# Altium schematic sheet RUMBA32.SchDoc
size A1; PageSetup: Record=PageOptions|CenterHorizontal=True|CenterVertical=True|PrintScale=0.68|XCorrection=1.00|YCorrection=1.00|PrintKind=1|BorderSize=5000000|LeftOffset=0|BottomOffset=0|Orientation=2|PaperLength=1000|PaperWidth=1000|Scale=100|PaperSource=7|PrintQuality=-4|MediaType=1|DitherType=10|PrintScaleMode=1|PaperKind=A3
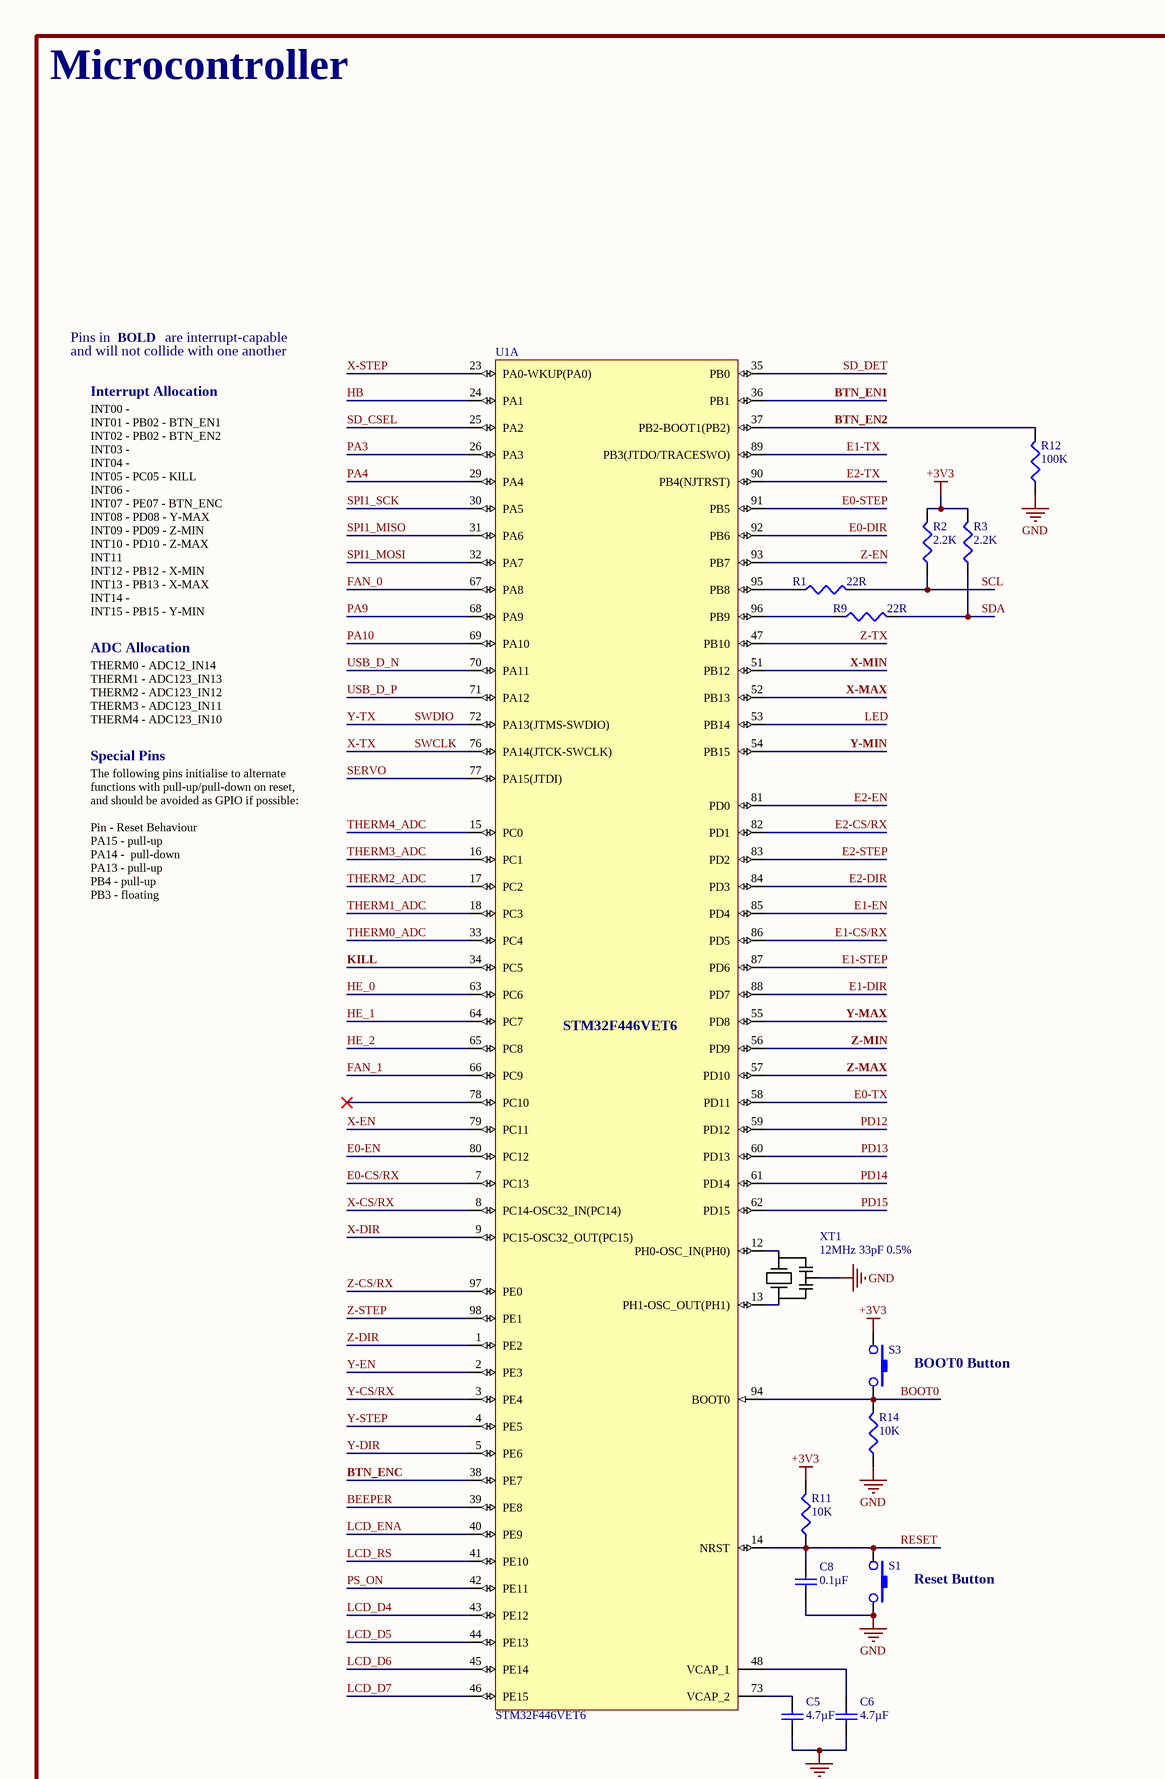
[diagram p0: RUMBA32.SchDoc, top left]
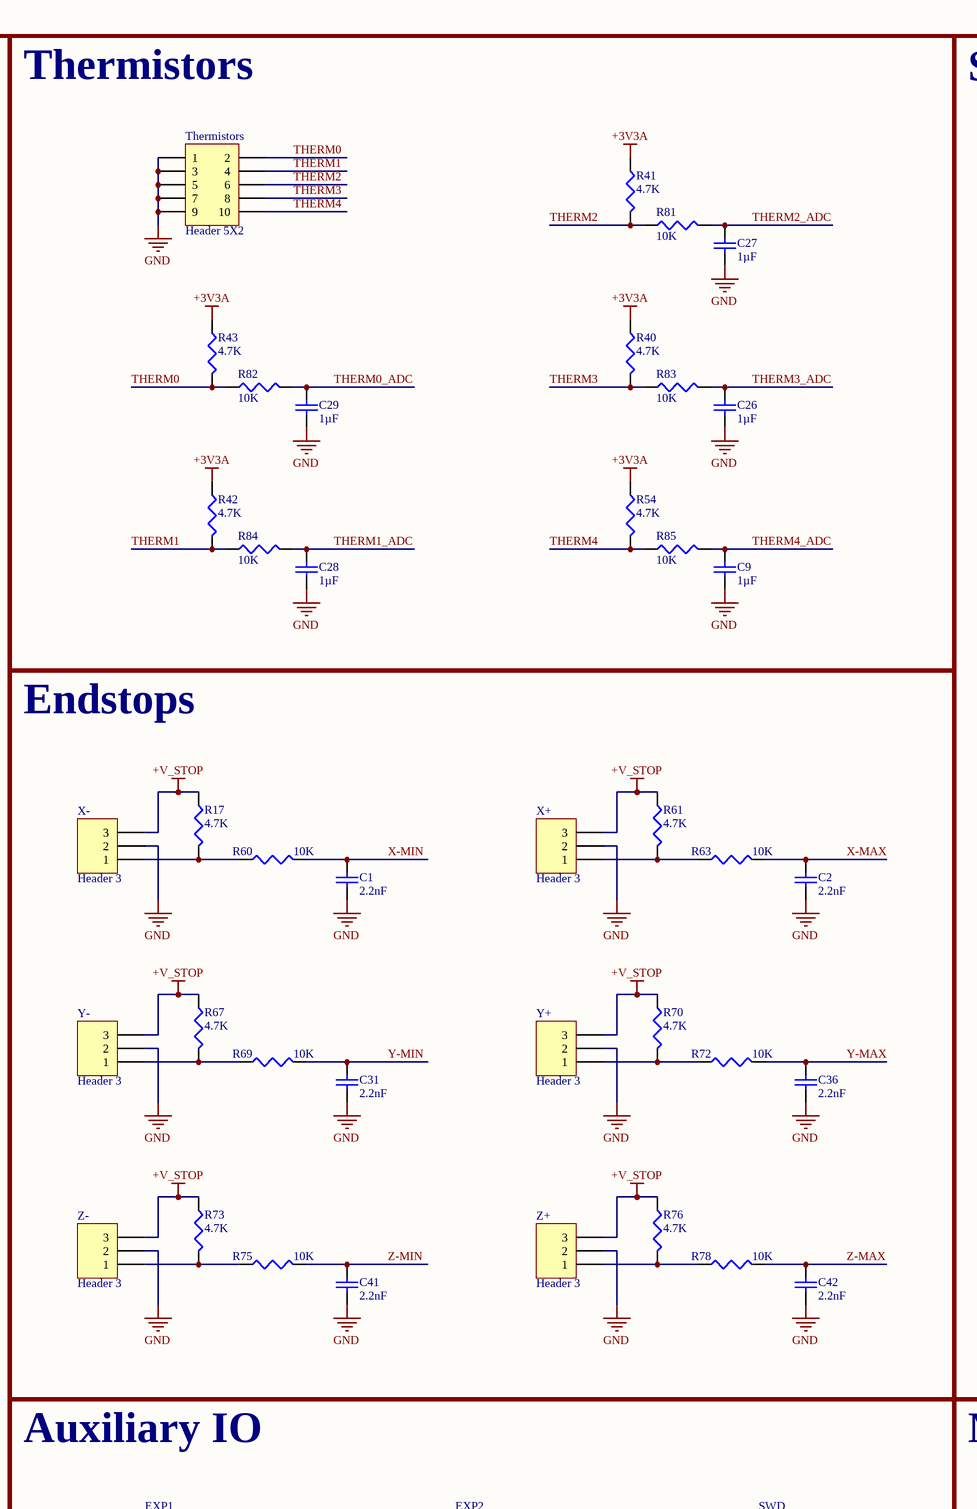
[diagram p1: RUMBA32.SchDoc, top middle]
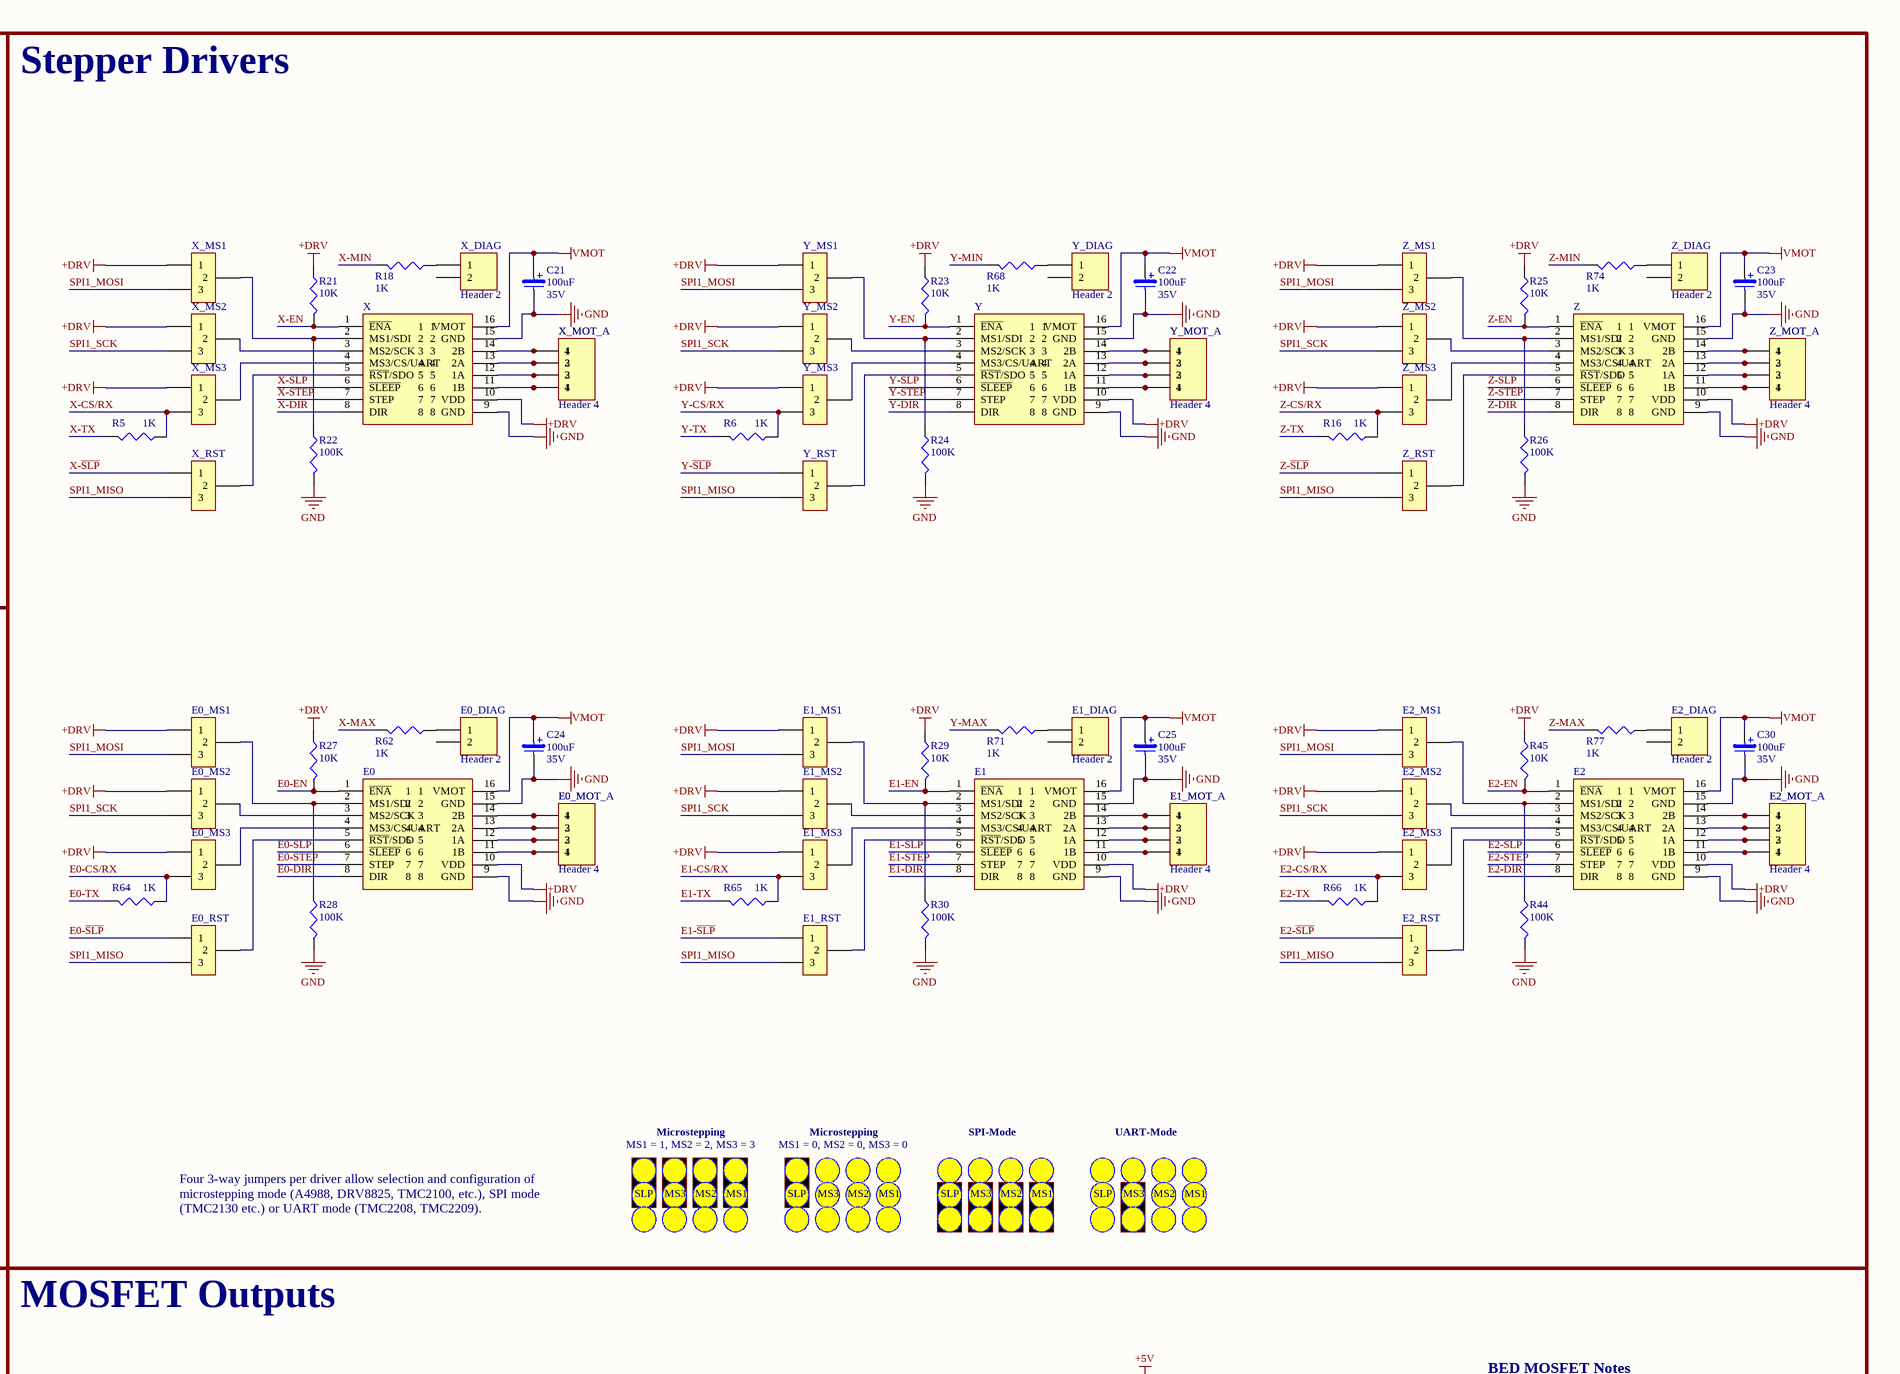
[diagram p2: RUMBA32.SchDoc, top right]
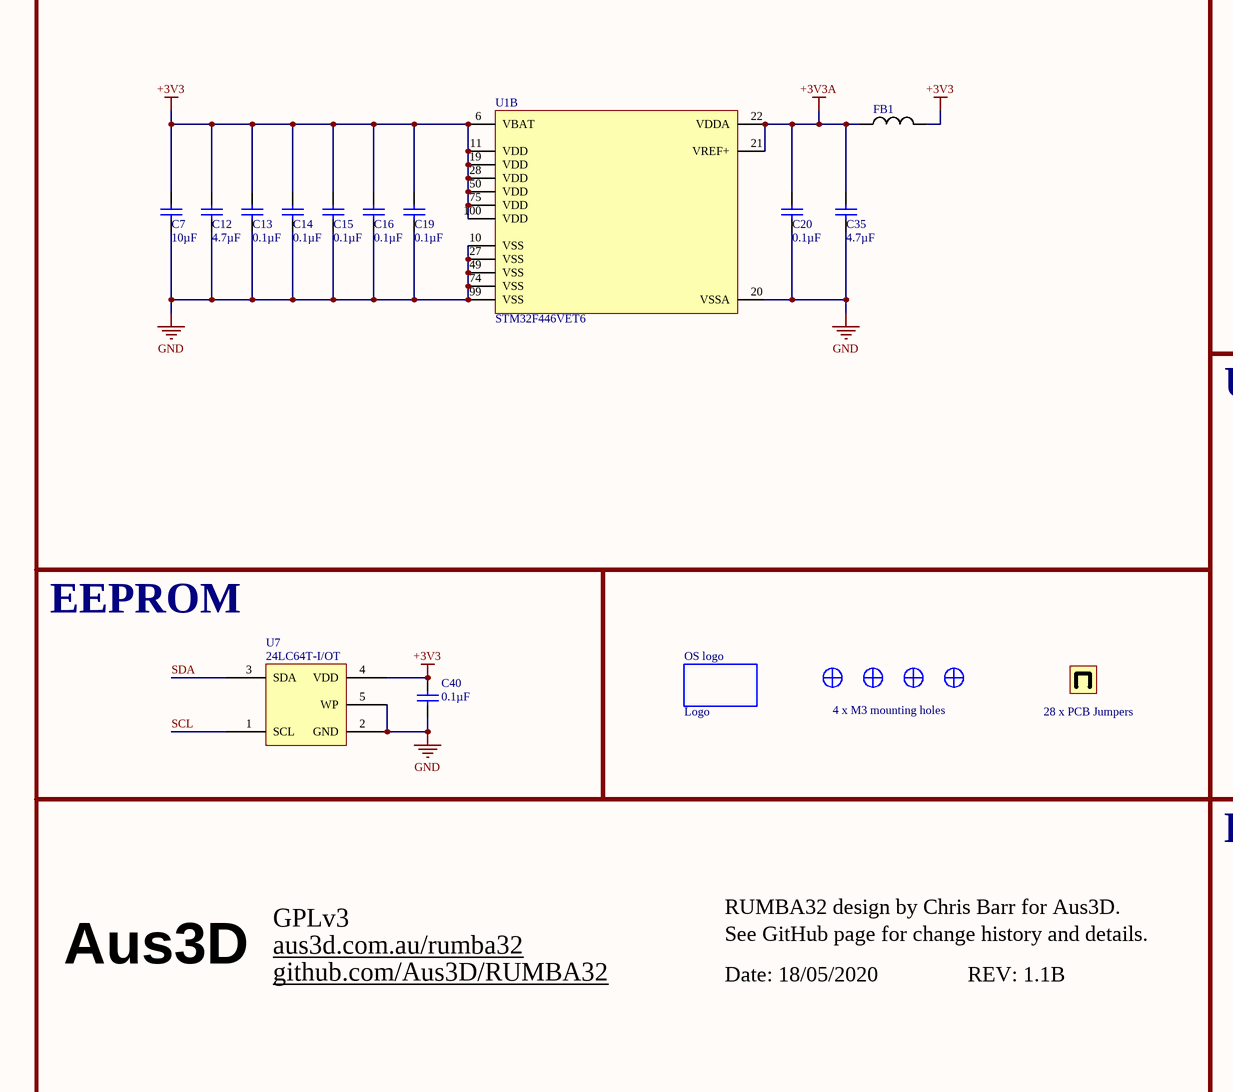
[diagram p3: RUMBA32.SchDoc, bottom left]
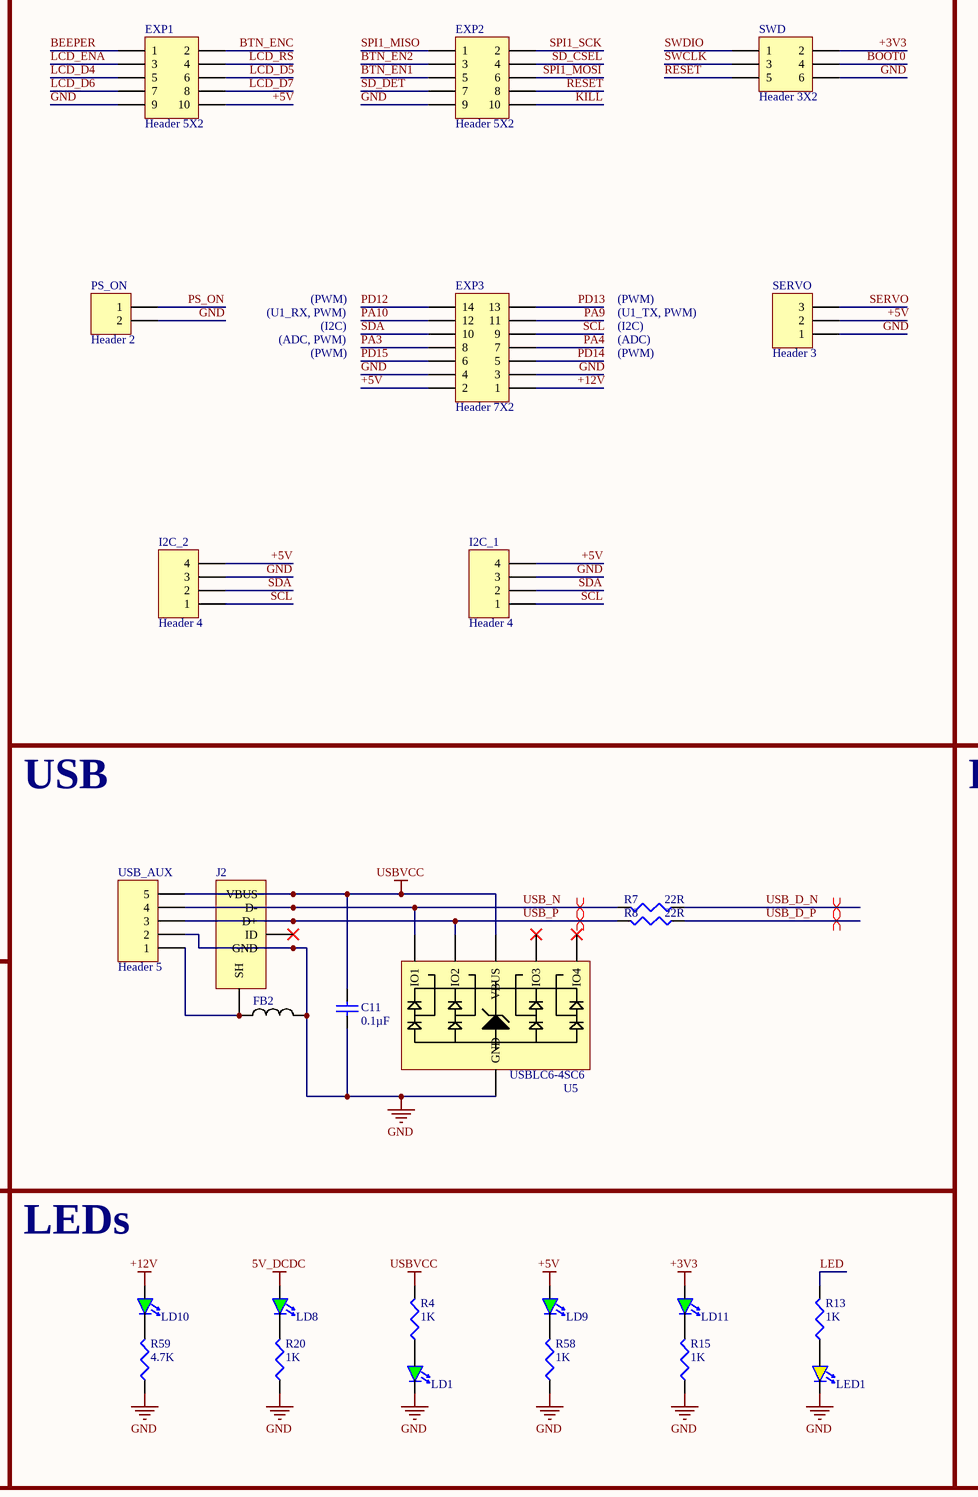
[diagram p4: RUMBA32.SchDoc, bottom middle]
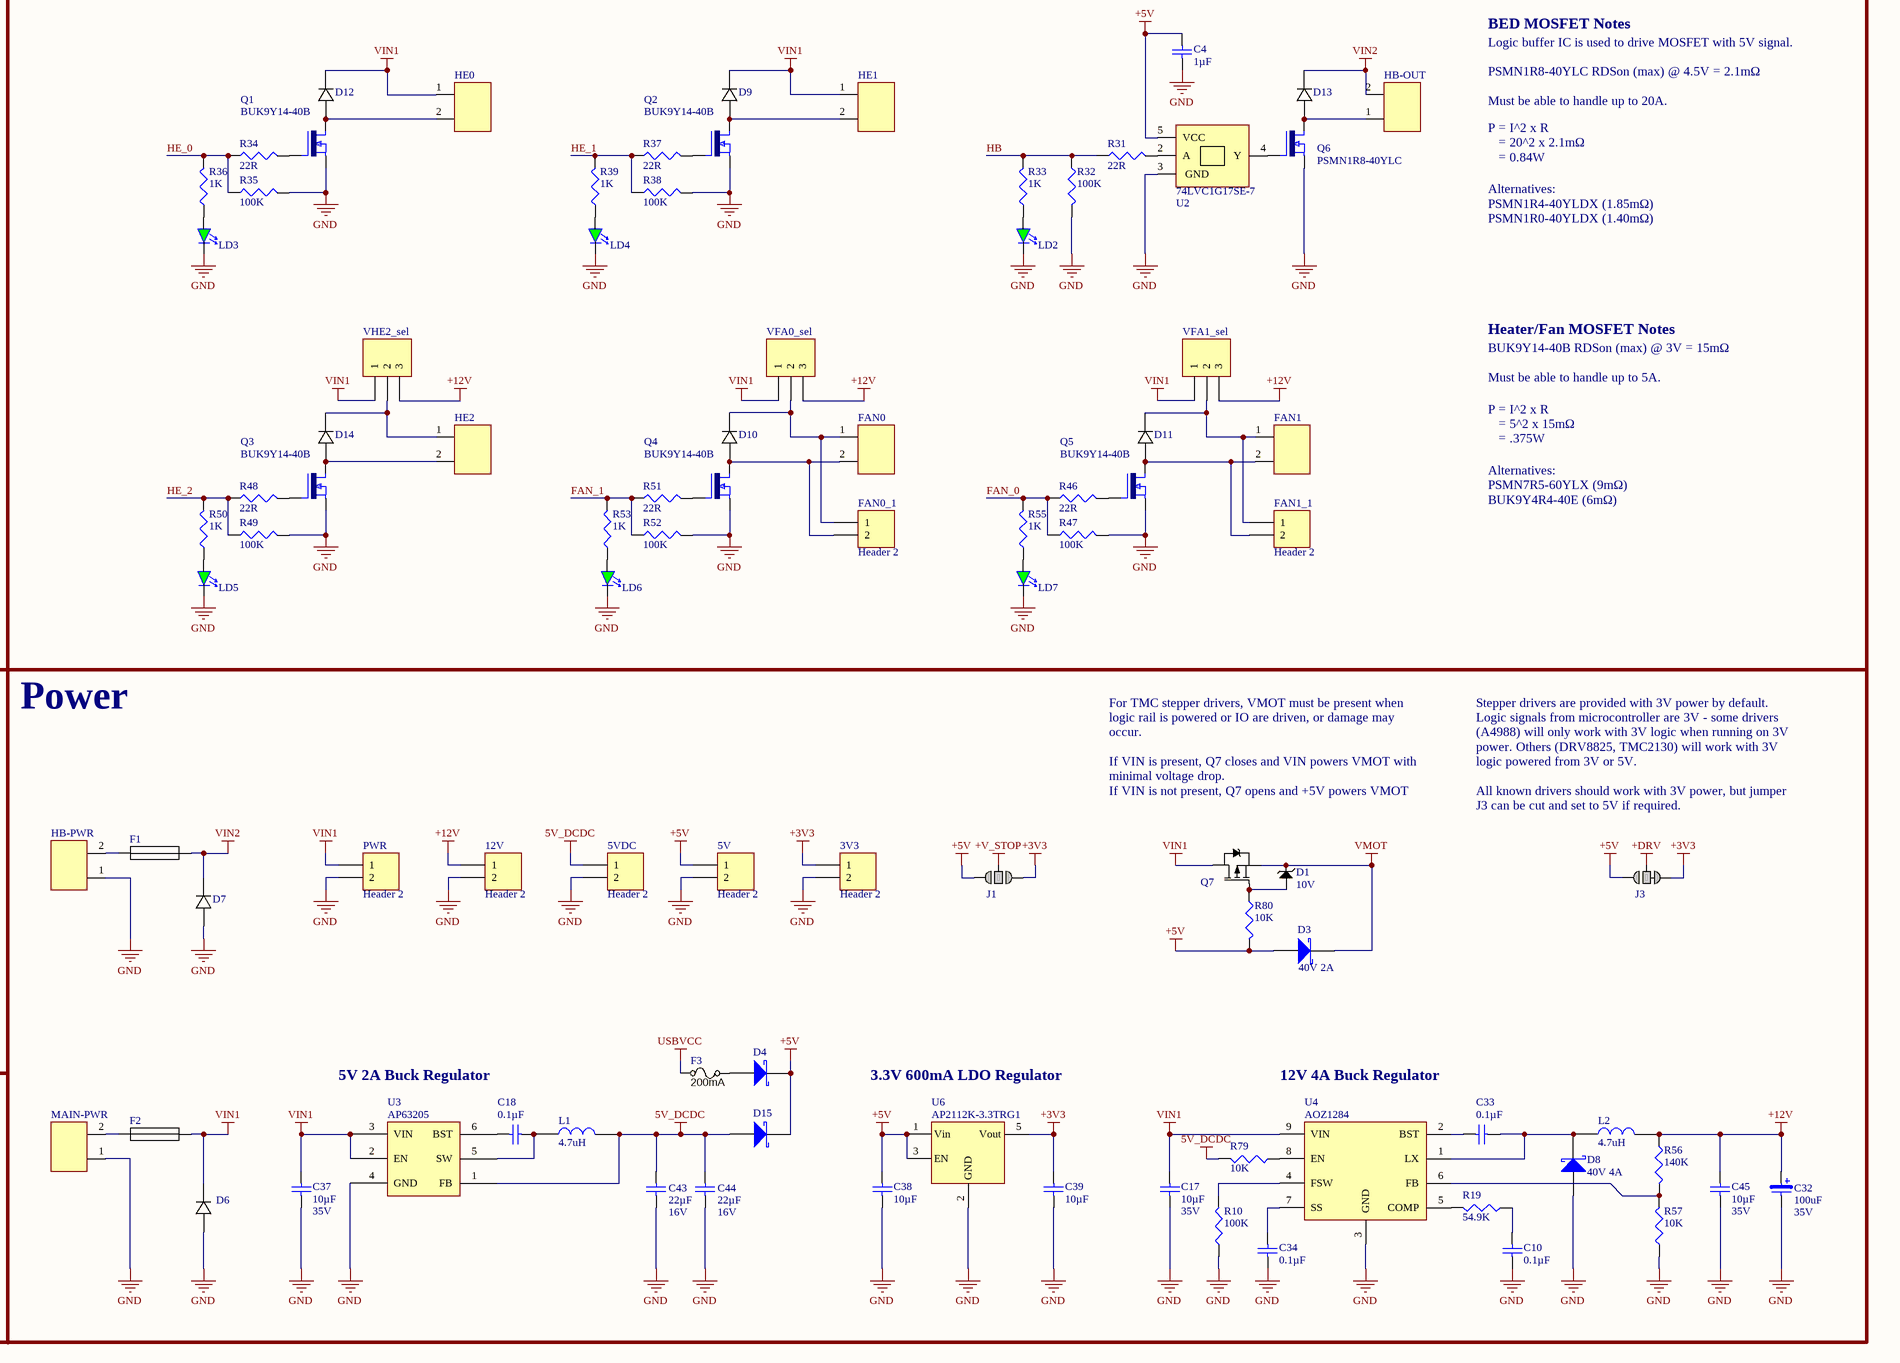
[diagram p5: RUMBA32.SchDoc, bottom right]

## Parts
(Parts that share a designator on the sheet are numbered #1, #2 ... from top to bottom, then left to right.)
3V3  Header 2  [HDR1X2-HEADER]
5V  Header 2  [HDR1X2-HEADER]
5VDC  Header 2  [HDR1X2-HEADER]
12V  Header 2  [HDR1X2-HEADER]
C1  value 2.2nF  [CAPC1005X55N]  (hidden comment: Capacitor)
C2  value 2.2nF  [CAPC1005X55N]  (hidden comment: Capacitor)
C4  value 1µF  [CAP 1005-0402]  (hidden comment: Capacitor)
C5  value 4.7µF  [CAP 1005-0402]  (hidden comment: Capacitor)
C6  value 4.7µF  [CAP 1005-0402]  (hidden comment: Capacitor)
C7  value 10µF  [CAPC1608X90N]  (hidden comment: Capacitor)
C8  value 0.1µF  [CAP 1005-0402]  (hidden comment: Capacitor)
C9  value 1µF  [CAPC1005X55N]  (hidden comment: Capacitor)
C10  value 0.1µF  [CAP 1005-0402]  (hidden comment: Capacitor)
C11  value 0.1µF  [CAP 1005-0402]  (hidden comment: Capacitor)
C12  value 4.7µF  [CAPC1005X55N]  (hidden comment: Capacitor)
C13  value 0.1µF  [CAP 1005-0402]  (hidden comment: Capacitor)
C14  value 0.1µF  [CAP 1005-0402]  (hidden comment: Capacitor)
C15  value 0.1µF  [CAP 1005-0402]  (hidden comment: Capacitor)
C16  value 0.1µF  [CAP 1005-0402]  (hidden comment: Capacitor)
C17  value 10µF  Voltage: 35V  [CAPC3225X220N]  (hidden comment: Capacitor)
C18  value 0.1µF  [CAP 1005-0402]  (hidden comment: Capacitor)
C19  value 0.1µF  [CAP 1005-0402]  (hidden comment: Capacitor)
C20  value 0.1µF  [CAP 1005-0402]  (hidden comment: Capacitor)
C21  value 100uF  Voltage: 35V  [CAP EL PANASONIC]
C22  value 100uF  Voltage: 35V  [CAP EL PANASONIC]
C23  value 100uF  Voltage: 35V  [CAP EL PANASONIC]
C24  value 100uF  Voltage: 35V  [CAP EL PANASONIC]
C25  value 100uF  Voltage: 35V  [CAP EL PANASONIC]
C26  value 1µF  [CAPC1005X55N]  (hidden comment: Capacitor)
C27  value 1µF  [CAPC1005X55N]  (hidden comment: Capacitor)
C28  value 1µF  [CAPC1005X55N]  (hidden comment: Capacitor)
C29  value 1µF  [CAPC1005X55N]  (hidden comment: Capacitor)
C30  value 100uF  Voltage: 35V  [CAP EL PANASONIC]
C31  value 2.2nF  [CAPC1005X55N]  (hidden comment: Capacitor)
C32  value 100uF  Voltage: 35V  [CAP EL PANASONIC]
C33  value 0.1µF  [CAP 1005-0402]  (hidden comment: Capacitor)
C34  value 0.1µF  [CAP 1005-0402]  (hidden comment: Capacitor)
C35  value 4.7µF  [CAP 1005-0402]  (hidden comment: Capacitor)
C36  value 2.2nF  [CAPC1005X55N]  (hidden comment: Capacitor)
C37  value 10µF  Voltage: 35V  [CAPC3225X220N]  (hidden comment: Capacitor)
C38  value 10µF  [CAPC1608X90N]  (hidden comment: Capacitor)
C39  value 10µF  [CAPC1608X90N]  (hidden comment: Capacitor)
C40  value 0.1µF  [CAP 1005-0402]  (hidden comment: Capacitor)
C41  value 2.2nF  [CAPC1005X55N]  (hidden comment: Capacitor)
C42  value 2.2nF  [CAPC1005X55N]  (hidden comment: Capacitor)
C43  value 22µF  Voltage: 16V  [CAPC3225X220N]  (hidden comment: Capacitor)
C44  value 22µF  Voltage: 16V  [CAPC3225X220N]  (hidden comment: Capacitor)
C45  value 10µF  Voltage: 35V  [CAPC3225X220N]  (hidden comment: Capacitor)
D1  Voltage: 10V  [SOD523]  (hidden comment: Zener 10V 150mW SOD523)
D3  value 40V 2A  [DIOM2616X08N]
D4  (no value)  [DIOM2616X08N]
D6  (no value)  [DO-214AC]
D7  (no value)  [DO-214AC]
D8  value 40V 4A  [DO-214AA]
D9  (no value)  [DO-214AC]
D10  (no value)  [DO-214AC]
D11  (no value)  [DO-214AC]
D12  (no value)  [DO-214AC]
D13  (no value)  [DO-214AC]
D14  (no value)  [DO-214AC]
D15  (no value)  [DIOM2616X08N]
E0  Header 8  [A4988BREAKOUT_2]  (value not drawn)  (no BOM)
E0_0  Header 8  [HDR1X8-HEADER]  (value not drawn)  (mechanical)
E0_1  Header 8  [HDR1X8-HEADER]  (value not drawn)  (mechanical)
E0_DIAG  Header 2  [HDR1X2-HEADER Female]
E0_MOT  (no value)  [TERM4 3.5mm]
E0_MOT_A  Header 4  [HDR1X4]
E0_MS1  Header 3  [HDR1X3-HEADER]  (value not drawn)
E0_MS2  Header 3  [HDR1X3-HEADER]  (value not drawn)
E0_MS3  Header 3  [HDR1X3-HEADER]  (value not drawn)
E0_RST  Header 3  [HDR1X3-HEADER]  (value not drawn)
E1  Header 8  [A4988BREAKOUT_2]  (value not drawn)  (no BOM)
E1_0  Header 8  [HDR1X8-HEADER]  (value not drawn)  (mechanical)
E1_1  Header 8  [HDR1X8-HEADER]  (value not drawn)  (mechanical)
E1_DIAG  Header 2  [HDR1X2-HEADER Female]
E1_MOT  (no value)  [TERM4 3.5mm]
E1_MOT_A  Header 4  [HDR1X4]
E1_MS1  Header 3  [HDR1X3-HEADER]  (value not drawn)
E1_MS2  Header 3  [HDR1X3-HEADER]  (value not drawn)
E1_MS3  Header 3  [HDR1X3-HEADER]  (value not drawn)
E1_RST  Header 3  [HDR1X3-HEADER]  (value not drawn)
E2  Header 8  [A4988BREAKOUT_2]  (value not drawn)  (no BOM)
E2_0  Header 8  [HDR1X8-HEADER]  (value not drawn)  (mechanical)
E2_1  Header 8  [HDR1X8-HEADER]  (value not drawn)  (mechanical)
E2_DIAG  Header 2  [HDR1X2-HEADER Female]
E2_MOT  (no value)  [TERM4 3.5mm]
E2_MOT_A  Header 4  [HDR1X4]
E2_MS1  Header 3  [HDR1X3-HEADER]  (value not drawn)
E2_MS2  Header 3  [HDR1X3-HEADER]  (value not drawn)
E2_MS3  Header 3  [HDR1X3-HEADER]  (value not drawn)
E2_RST  Header 3  [HDR1X3-HEADER]  (value not drawn)
EXP1  Header 5X2  [HDR2X5_exp Iner only\]
EXP2  Header 5X2  [HDR2X5_exp Iner only\]
EXP3  Header 7X2  [HDR2X7]
F1  (no value)  [Fuseholder - BK-6013 - Mini ATC ATO Blade 15A]
F2  (no value)  [Fuseholder - BK-6013 - Mini ATC ATO Blade 15A]
F3  value 200mA  [FUSE 1608-0603]
FAN0  (no value)  [TERM2 3.5mm]
FAN0_1  Header 2  [HDR1X2]
FAN1  (no value)  [TERM2 3.5mm]
FAN1_1  Header 2  [HDR1X2]
FB1  Ferrite Bead SMD 0402  [RESC1005X40N]  (value not drawn)
FB2  Ferrite Bead SMD 0402  [RESC1005X40N]  (value not drawn)
HB-OUT  (no value)  [TERM2 5MM]
HB-PWR  (no value)  [TERM2 5MM]
HE0  (no value)  [TERM2 3.5mm]
HE1  (no value)  [TERM2 3.5mm]
HE2  (no value)  [TERM2 3.5mm]
I2C_1  Header 4  [HDR1X4-HEADER]
I2C_2  Header 4  [HDR1X4-HEADER]
J1  Jumper  [Jump_3Way - SMALL]  (value not drawn)  (no BOM)
J2  (no value)  [Micro-USB B Molex 105017-0001]
J3  Jumper  [Jump_3Way - SMALL]  (value not drawn)  (no BOM)
JMP1  Green  (value not drawn)  (mechanical)
JMP#1  Green  (value not drawn)  (mechanical)
JMP#2  Green  (value not drawn)  (mechanical)
JMP#3  Green  (value not drawn)  (mechanical)
JMP#4  Green  (value not drawn)  (mechanical)
JMP#5  Green  (value not drawn)  (mechanical)
JMP#6  Green  (value not drawn)  (mechanical)
JMP#7  Green  (value not drawn)  (mechanical)
JMP#8  Green  (value not drawn)  (mechanical)
JMP#9  Green  (value not drawn)  (mechanical)
JMP#10  Green  (value not drawn)  (mechanical)
JMP#11  Green  (value not drawn)  (mechanical)
JMP#12  Green  (value not drawn)  (mechanical)
JMP#13  Green  (value not drawn)  (mechanical)
JMP#14  Green  (value not drawn)  (mechanical)
JMP#15  Green  (value not drawn)  (mechanical)
JMP#16  Green  (value not drawn)  (mechanical)
JMP#17  Green  (value not drawn)  (mechanical)
JMP#18  Green  (value not drawn)  (mechanical)
JMP#19  Green  (value not drawn)  (mechanical)
JMP#20  Green  (value not drawn)  (mechanical)
JMP#21  Green  (value not drawn)  (mechanical)
JMP#22  Green  (value not drawn)  (mechanical)
JMP#23  Green  (value not drawn)  (mechanical)
JMP#24  Green  (value not drawn)  (mechanical)
JMP#25  Green  (value not drawn)  (mechanical)
JMP#26  Green  (value not drawn)  (mechanical)
JMP#27  Green  (value not drawn)  (mechanical)
L1  value 4.7uH  [SRN6045TA SMD Inductor]
L2  value 4.7uH  [SRN6045TA SMD Inductor]
LD1  (no value)  [LED 1608-0603]
LD2  (no value)  [LED 1608-0603]
LD3  (no value)  [LED 1608-0603]
LD4  (no value)  [LED 1608-0603]
LD5  (no value)  [LED 1608-0603]
LD6  (no value)  [LED 1608-0603]
LD7  (no value)  [LED 1608-0603]
LD8  (no value)  [LED 1608-0603]
LD9  (no value)  [LED 1608-0603]
LD10  (no value)  [LED 1608-0603]
LD11  (no value)  [LED 1608-0603]
LED1  (no value)  [LED 1608-0603]
MAIN-PWR  (no value)  [TERM2 5MM]
OS_logo  Logo  [OS LOGO TOP]  (no BOM)
PS_ON  Header 2  [HDR1X2-HEADER]
PWR  Header 2  [HDR1X2-HEADER]
Q1  BUK9Y14-40B  [LFPACK]
Q2  BUK9Y14-40B  [LFPACK]
Q3  BUK9Y14-40B  [LFPACK]
Q4  BUK9Y14-40B  [LFPACK]
Q5  BUK9Y14-40B  [LFPACK]
Q6  PSMN1R8-40YLC  [LFPACK]
Q7  Si2371EDS  [SOT23-3 New]  (value not drawn)
R1  value 22R  [RESC1005X40N]  (hidden comment: Resistor)
R2  value 2.2K  [RESC1005X40N]  (hidden comment: Resistor)
R3  value 2.2K  [RESC1005X40N]  (hidden comment: Resistor)
R4  value 1K  [RESC1005X40N]  (hidden comment: Resistor)
R5  value 1K  [RESC1005X40N]  (hidden comment: Resistor)
R6  value 1K  [RESC1005X40N]  (hidden comment: Resistor)
R7  value 22R  [RESC1005X40N]  (hidden comment: Resistor)
R8  value 22R  [RESC1005X40N]  (hidden comment: Resistor)
R9  value 22R  [RESC1005X40N]  (hidden comment: Resistor)
R10  value 100K  [RESC1005X40N]  (hidden comment: Resistor)
R11  value 10K  [RESC1005X40N]  (hidden comment: Resistor)
R12  value 100K  [RESC1005X40N]  (hidden comment: Resistor)
R13  value 1K  [RESC1005X40N]  (hidden comment: Resistor)
R14  value 10K  [RESC1005X40N]  (hidden comment: Resistor)
R15  value 1K  [RESC1005X40N]  (hidden comment: Resistor)
R16  value 1K  [RESC1005X40N]  (hidden comment: Resistor)
R17  value 4.7K  [RESC1005X40N]  (hidden comment: Resistor)
R18  value 1K  [RESC1005X40N]  (hidden comment: Resistor)
R19  value 54.9K  [RESC1005X40N]  (hidden comment: Resistor)
R20  value 1K  [RESC1005X40N]  (hidden comment: Resistor)
R21  value 10K  [RESC1005X40N]  (hidden comment: Resistor)
R22  value 100K  [RESC1005X40N]  (hidden comment: Resistor)
R23  value 10K  [RESC1005X40N]  (hidden comment: Resistor)
R24  value 100K  [RESC1005X40N]  (hidden comment: Resistor)
R25  value 10K  [RESC1005X40N]  (hidden comment: Resistor)
R26  value 100K  [RESC1005X40N]  (hidden comment: Resistor)
R27  value 10K  [RESC1005X40N]  (hidden comment: Resistor)
R28  value 100K  [RESC1005X40N]  (hidden comment: Resistor)
R29  value 10K  [RESC1005X40N]  (hidden comment: Resistor)
R30  value 100K  [RESC1005X40N]  (hidden comment: Resistor)
R31  value 22R  [RESC1005X40N]  (hidden comment: Resistor)
R32  value 100K  [RESC1005X40N]  (hidden comment: Resistor)
R33  value 1K  [RESC1005X40N]  (hidden comment: Resistor)
R34  value 22R  [RESC1005X40N]  (hidden comment: Resistor)
R35  value 100K  [RESC1005X40N]  (hidden comment: Resistor)
R36  value 1K  [RESC1005X40N]  (hidden comment: Resistor)
R37  value 22R  [RESC1005X40N]  (hidden comment: Resistor)
R38  value 100K  [RESC1005X40N]  (hidden comment: Resistor)
R39  value 1K  [RESC1005X40N]  (hidden comment: Resistor)
R40  value 4.7K  [RESC1005X40N]  (hidden comment: Resistor)
R41  value 4.7K  [RESC1005X40N]  (hidden comment: Resistor)
R42  value 4.7K  [RESC1005X40N]  (hidden comment: Resistor)
R43  value 4.7K  [RESC1005X40N]  (hidden comment: Resistor)
R44  value 100K  [RESC1005X40N]  (hidden comment: Resistor)
R45  value 10K  [RESC1005X40N]  (hidden comment: Resistor)
R46  value 22R  [RESC1005X40N]  (hidden comment: Resistor)
R47  value 100K  [RESC1005X40N]  (hidden comment: Resistor)
R48  value 22R  [RESC1005X40N]  (hidden comment: Resistor)
R49  value 100K  [RESC1005X40N]  (hidden comment: Resistor)
R50  value 1K  [RESC1005X40N]  (hidden comment: Resistor)
R51  value 22R  [RESC1005X40N]  (hidden comment: Resistor)
R52  value 100K  [RESC1005X40N]  (hidden comment: Resistor)
R53  value 1K  [RESC1005X40N]  (hidden comment: Resistor)
R54  value 4.7K  [RESC1005X40N]  (hidden comment: Resistor)
R55  value 1K  [RESC1005X40N]  (hidden comment: Resistor)
R56  value 140K  [RESC1005X40N]  (hidden comment: Resistor)
R57  value 10K  [RESC1005X40N]  (hidden comment: Resistor)
R58  value 1K  [RESC1005X40N]  (hidden comment: Resistor)
R59  value 4.7K  [RESC1005X40N]  (hidden comment: Resistor)
R60  value 10K  [RESC1005X40N]  (hidden comment: Resistor)
R61  value 4.7K  [RESC1005X40N]  (hidden comment: Resistor)
R62  value 1K  [RESC1005X40N]  (hidden comment: Resistor)
R63  value 10K  [RESC1005X40N]  (hidden comment: Resistor)
R64  value 1K  [RESC1005X40N]  (hidden comment: Resistor)
R65  value 1K  [RESC1005X40N]  (hidden comment: Resistor)
R66  value 1K  [RESC1005X40N]  (hidden comment: Resistor)
R67  value 4.7K  [RESC1005X40N]  (hidden comment: Resistor)
R68  value 1K  [RESC1005X40N]  (hidden comment: Resistor)
R69  value 10K  [RESC1005X40N]  (hidden comment: Resistor)
R70  value 4.7K  [RESC1005X40N]  (hidden comment: Resistor)
R71  value 1K  [RESC1005X40N]  (hidden comment: Resistor)
R72  value 10K  [RESC1005X40N]  (hidden comment: Resistor)
R73  value 4.7K  [RESC1005X40N]  (hidden comment: Resistor)
R74  value 1K  [RESC1005X40N]  (hidden comment: Resistor)
R75  value 10K  [RESC1005X40N]  (hidden comment: Resistor)
R76  value 4.7K  [RESC1005X40N]  (hidden comment: Resistor)
R77  value 1K  [RESC1005X40N]  (hidden comment: Resistor)
R78  value 10K  [RESC1005X40N]  (hidden comment: Resistor)
R79  value 10K  [RESC1005X40N]  (hidden comment: Resistor)
R80  value 10K  [RESC1005X40N]  (hidden comment: Resistor)
R81  value 10K  [RESC1005X40N]  (hidden comment: Resistor)
R82  value 10K  [RESC1005X40N]  (hidden comment: Resistor)
R83  value 10K  [RESC1005X40N]  (hidden comment: Resistor)
R84  value 10K  [RESC1005X40N]  (hidden comment: Resistor)
R85  value 10K  [RESC1005X40N]  (hidden comment: Resistor)
S1  Momentary Tactile Button  [SW-PB SMD 2pin]  (value not drawn)
S3  Momentary Tactile Button  [SW-PB SMD 2pin]  (value not drawn)
sc1  Sraf  [Sraf 3mm - rupa 3.2]  (value not drawn)  (no BOM)
sc2  Sraf  [Sraf 3mm - rupa 3.2]  (value not drawn)  (no BOM)
sc3  Sraf  [Sraf 3mm - rupa 3.5]  (value not drawn)  (no BOM)
sc4  Sraf  [Sraf 3mm - rupa 3.5]  (value not drawn)  (no BOM)
SERVO  Header 3  [HDR1X3-HEADER]
SWD  Header 3X2  [HDR2X3]
Thermistors  Header 5X2  [HDR2X5]
U1  STM32F446VET6  [STM-LQFP100_N]  (parts A,B of 2)
U2  74LVC1G17SE-7  [SOT353]
U3  AP63205  [TSOT23-6]
U4  AOZ1284  [SOIC127P600X170_HS-9N]
U5  USBLC6-4SC6  [TSOT23-6]
U6  AP2112K-3.3TRG1  [SOT23-5]
U7  24LC64T-I/OT  [SOT23-5]
USB_AUX  Header 5  [HDR1X5-HEADER]
VFA0_sel  Header 3  [HDR1X3-HEADER]  (value not drawn)
VFA1_sel  Header 3  [HDR1X3-HEADER]  (value not drawn)
VHE2_sel  Header 3  [HDR1X3-HEADER]  (value not drawn)
X  Header 8  [A4988BREAKOUT_2]  (value not drawn)  (no BOM)
X+  Header 3  [HDR1X3-HEADER]
X-  Header 3  [HDR1X3-HEADER]
X_0  Header 8  [HDR1X8-HEADER]  (value not drawn)  (mechanical)
X_1  Header 8  [HDR1X8-HEADER]  (value not drawn)  (mechanical)
X_DIAG  Header 2  [HDR1X2-HEADER Female]
X_MOT  (no value)  [TERM4 3.5mm]
X_MOT_A  Header 4  [HDR1X4]
X_MS1  Header 3  [HDR1X3-HEADER]  (value not drawn)
X_MS2  Header 3  [HDR1X3-HEADER]  (value not drawn)
X_MS3  Header 3  [HDR1X3-HEADER]  (value not drawn)
X_RST  Header 3  [HDR1X3-HEADER]  (value not drawn)
XT1  12MHz 33pF 0.5%  [CERALOCK CSTCE_G]
Y  Header 8  [A4988BREAKOUT_2]  (value not drawn)  (no BOM)
Y+  Header 3  [HDR1X3-HEADER]
Y-  Header 3  [HDR1X3-HEADER]
Y_0  Header 8  [HDR1X8-HEADER]  (value not drawn)  (mechanical)
Y_1  Header 8  [HDR1X8-HEADER]  (value not drawn)  (mechanical)
Y_DIAG  Header 2  [HDR1X2-HEADER Female]
Y_MOT  (no value)  [TERM4 3.5mm]
Y_MOT_A  Header 4  [HDR1X4]
Y_MS1  Header 3  [HDR1X3-HEADER]  (value not drawn)
Y_MS2  Header 3  [HDR1X3-HEADER]  (value not drawn)
Y_MS3  Header 3  [HDR1X3-HEADER]  (value not drawn)
Y_RST  Header 3  [HDR1X3-HEADER]  (value not drawn)
Z  Header 8  [A4988BREAKOUT_2]  (value not drawn)  (no BOM)
Z+  Header 3  [HDR1X3-HEADER]
Z-  Header 3  [HDR1X3-HEADER]
Z_0  Header 8  [HDR1X8-HEADER]  (value not drawn)  (mechanical)
Z_1  Header 8  [HDR1X8-HEADER]  (value not drawn)  (mechanical)
Z_DIAG  Header 2  [HDR1X2-HEADER Female]
Z_MOT  (no value)  [TERM4 3.5mm]
Z_MOT_A  Header 4  [HDR1X4]
Z_MS1  Header 3  [HDR1X3-HEADER]  (value not drawn)
Z_MS2  Header 3  [HDR1X3-HEADER]  (value not drawn)
Z_MS3  Header 3  [HDR1X3-HEADER]  (value not drawn)
Z_RST  Header 3  [HDR1X3-HEADER]  (value not drawn)

## Blocks framed on the sheet
Microcontroller: C5-C8 C12-C16 C19 C20 C35 FB1 R1-R3 R9 R11 R12 R14 S1 S3 U1 XT1
Thermistors: C9 C26-C29 R40-R43 R54 R81-R85 Thermistors
Stepper Drivers: C21-C25 C30 E0 E0_0 E0_1 E0_DIAG E0_MOT E0_MOT_A E0_MS1-E0_MS3 E0_RST E1 E1_0 E1_1 E1_DIAG E1_MOT E1_MOT_A E1_MS1-E1_MS3 E1_RST E2 E2_0 E2_1 E2_DIAG E2_MOT E2_MOT_A E2_MS1-E2_MS3 E2_RST R5 R6 R16 R18 R21-R30 R44 R45 R62 R64-R66 R68 R71 R74 R77 X X_0 X_1 X_DIAG X_MOT X_MOT_A X_MS1-X_MS3 X_RST Y Y_0 Y_1 Y_DIAG Y_MOT Y_MOT_A Y_MS1-Y_MS3 Y_RST Z Z_0 Z_1 Z_DIAG Z_MOT Z_MOT_A Z_MS1-Z_MS3 Z_RST
Endstops: C1 C2 C31 C36 C41 C42 R17 R60 R61 R63 R67 R69 R70 R72 R73 R75 R76 R78 X+ X- Y+ Y- Z+ Z-
Auxiliary IO: EXP1-EXP3 I2C_1 I2C_2 PS_ON SERVO SWD
MOSFET Outputs: C4 D9-D14 FAN0 FAN0_1 FAN1 FAN1_1 HB-OUT HE0-HE2 LD2-LD7 Q1-Q6 R31-R39 R46-R53 R55 U2 VFA0_sel VFA1_sel VHE2_sel
USB: C11 FB2 J2 R7 R8 U5 USB_AUX
Power: 3V3 5V 5VDC 12V C10 C17 C18 C32-C34 C37-C39 C43-C45 D1 D3 D4 D6-D8 D15 F1-F3 HB-PWR J1 J3 L1 L2 MAIN-PWR PWR Q7 R10 R19 R56 R57 R79 R80 U3 U4 U6
EEPROM: C40 U7
LEDs: LD1 LD8-LD11 LED1 R4 R13 R15 R20 R58 R59

## Nets
5V_DCDC: 5VDC.1 C43.2 C44.2 D15.A L1.2 LD8.1(A) R79.2 U3.1(FB)
+3V3: 3V3.1 C7.2 C12.2 C13.2 C14.2 C15.2 C16.2 C19.2 C39.2 C40.2 FB1.2 J1.1 J3.1 LD11.1(A) R2.2 R3.2 R11.2 S3.1 SWD.2 U1.6(VBAT) U1.11(VDD) U1.19(VDD) U1.28(VDD) U1.50(VDD) U1.75(VDD) U1.100(VDD) U6.5(Vout) U7.4(VDD)
+3V3A: C20.2 C35.2 FB1.1 R40.1 R41.1 R42.1 R43.1 R54.1 U1.21(VREF+) U1.22(VDDA)
+5V: 5V.1 C4.2 C38.2 D3.A D4.K D15.K EXP1.10 EXP3.2 I2C_1.4 I2C_2.4 J1.3 J3.3 LD9.1(A) R80.2 SERVO.2 U2.5(VCC) U6.1(Vin) U6.3(EN)
+12V: 12V.1 C32.1 C45.2 EXP3.1 L2.2 LD10.1(A) R56.1 VFA0_sel.3 VFA1_sel.3 VHE2_sel.3
+DRV: E0.10(VDD) E0_MS1.1 E0_MS2.1 E0_MS3.1 E1.10(VDD) E1_MS1.1 E1_MS2.1 E1_MS3.1 E2.10(VDD) E2_MS1.1 E2_MS2.1 E2_MS3.1 J3.2 R21.1 R23.1 R25.1 R27.1 R29.1 R45.1 X.10(VDD) X_MS1.1 X_MS2.1 X_MS3.1 Y.10(VDD) Y_MS1.1 Y_MS2.1 Y_MS3.1 Z.10(VDD) Z_MS1.1 Z_MS2.1 Z_MS3.1
+V_STOP: J1.2 R17.1 R61.1 R67.1 R70.1 R73.1 R76.1 X+.3 X-.3 Y+.3 Y-.3 Z+.3 Z-.3
GND: 3V3.2 5V.2 5VDC.2 12V.2 C1.1 C2.1 C4.1 C5.1 C6.1 C7.1 C8.1 C9.1 C10.2 C11.1 C12.1 C13.1 C14.1 C15.1 C16.1 C17.1 C19.1 C20.1 C21.2 C22.2 C23.2 C24.2 C25.2 C26.1 C27.1 C28.1 C29.1 C30.2 C31.1 C32.2 C34.1 C35.1 C36.1 C37.1 C38.1 C39.1 C40.1 C41.1 C42.1 C43.1 C44.1 C45.1 D6.A D7.A D8.A E0.9(GND) E0.15(GND) E1.9(GND) E1.15(GND) E2.9(GND) E2.15(GND) EXP1.9 EXP2.9 EXP3.3 EXP3.4 FB2.2 HB-PWR.1 I2C_1.3 I2C_2.3 J2.GND LD1.2(K) LD2.2(K) LD3.2(K) LD4.2(K) LD5.2(K) LD6.2(K) LD7.2(K) LED1.2(K) MAIN-PWR.1 PS_ON.2 PWR.2 Q1.3(S) Q2.3(S) Q3.3(S) Q4.3(S) Q5.3(S) Q6.3(S) R10.1 R12.1 R14.1 R15.1 R20.1 R22.2 R24.2 R26.2 R28.2 R30.2 R32.2 R35.2 R38.2 R44.2 R47.2 R49.2 R52.2 R57.1 R58.1 R59.1 S1.2 SERVO.1 SWD.6 Thermistors.1 Thermistors.3 Thermistors.5 Thermistors.7 Thermistors.9 U1.10(VSS) U1.20(VSSA) U1.27(VSS) U1.49(VSS) U1.74(VSS) U1.99(VSS) U2.3(GND) U3.4(GND) U4.3(GND) U5.2(GND) U6.2(GND) U7.2(GND) U7.5(WP) USB_AUX.2 X.9(GND) X.15(GND) X+.2 X-.2 XT1.2(GND) Y.9(GND) Y.15(GND) Y+.2 Y-.2 Z.9(GND) Z.15(GND) Z+.2 Z-.2
USBVCC: C11.2 F3.1 J2.VBUS R4.2 U5.5(VBUS) USB_AUX.5
VIN1: C17.2 C37.2 D6.K D9.K D12.K F2.0 HE0.1 HE1.1 PWR.1 Q7.3(D) U3.2(EN) U3.3(VIN) U4.9(VIN) VFA0_sel.1 VFA1_sel.1 VHE2_sel.1
VIN2: D7.K D13.K F1.1 HB-OUT.2
VMOT: C21.1 C22.1 C23.1 C24.1 C25.1 C30.1 D1.K D3.K E0.16(VMOT) E1.16(VMOT) E2.16(VMOT) Q7.2(S) X.16(VMOT) Y.16(VMOT) Z.16(VMOT)
BEEPER: EXP1.1 U1.39(PE8)
BOOT0: R14.2 S3.2 SWD.4 U1.94(BOOT0)
BTN_EN1: EXP2.5 U1.36(PB1)
BTN_EN2: EXP2.3 R12.2 U1.37(PB2-BOOT1(PB2))
BTN_ENC: EXP1.2 U1.38(PE7)
E0-CS/RX: E0_MS3.3 R64.1 U1.7(PC13)
E0-DIR: E0.8(DIR) U1.92(PB6)
E0-EN: E0.1(~{ENA}) R27.2 U1.80(PC12)
E0-~{SLP}: E0.6(~{SLEEP}) E0_RST.1
E0-STEP: E0.7(STEP) U1.91(PB5)
E0-TX: R64.2 U1.58(PD11)
E1-CS/RX: E1_MS3.3 R65.1 U1.86(PD5)
E1-DIR: E1.8(DIR) U1.88(PD7)
E1-EN: E1.1(~{ENA}) R29.2 U1.85(PD4)
E1-~{SLP}: E1.6(~{SLEEP}) E1_RST.1
E1-STEP: E1.7(STEP) U1.87(PD6)
E1-TX: R65.2 U1.89(PB3(JTDO/TRACESWO))
E2-CS/RX: E2_MS3.3 R66.1 U1.82(PD1)
E2-DIR: E2.8(DIR) U1.84(PD3)
E2-EN: E2.1(~{ENA}) R45.2 U1.81(PD0)
E2-~{SLP}: E2.6(~{SLEEP}) E2_RST.1
E2-STEP: E2.7(STEP) U1.83(PD2)
E2-TX: R66.2 U1.90(PB4(NJTRST))
FAN_0: R46.1 R47.1 R55.2 U1.67(PA8)
FAN_1: R51.1 R52.1 R53.2 U1.66(PC9)
HB: R31.1 R32.1 R33.2 U1.24(PA1)
HE_0: R34.1 R35.1 R36.2 U1.63(PC6)
HE_1: R37.1 R38.1 R39.2 U1.64(PC7)
HE_2: R48.1 R49.1 R50.2 U1.65(PC8)
KILL: EXP2.10 U1.34(PC5)
LCD_D4: EXP1.5 U1.43(PE12)
LCD_D5: EXP1.6 U1.44(PE13)
LCD_D6: EXP1.7 U1.45(PE14)
LCD_D7: EXP1.8 U1.46(PE15)
LCD_ENA: EXP1.3 U1.40(PE9)
LCD_RS: EXP1.4 U1.41(PE10)
LED: R13.2 U1.53(PB14)
PA3: EXP3.8 U1.26(PA3)
PA4: EXP3.7 U1.29(PA4)
PA9: EXP3.11 U1.68(PA9)
PA10: EXP3.12 U1.69(PA10)
PD12: EXP3.14 U1.59(PD12)
PD13: EXP3.13 U1.60(PD13)
PD14: EXP3.5 U1.61(PD14)
PD15: EXP3.6 U1.62(PD15)
PS_ON: PS_ON.1 U1.42(PE11)
RESET: C8.2 EXP2.8 R11.1 S1.1 SWD.5 U1.14(NRST)
SCL: EXP3.9 I2C_1.1 I2C_2.1 R1.2 R2.1 U7.1(SCL)
SD_CSEL: EXP2.4 U1.25(PA2)
SD_DET: EXP2.7 U1.35(PB0)
SDA: EXP3.10 I2C_1.2 I2C_2.2 R3.1 R9.2 U7.3(SDA)
SERVO: SERVO.3 U1.77(PA15(JTDI))
SPI1_MISO: E0_RST.3 E1_RST.3 E2_RST.3 EXP2.1 U1.31(PA6) X_RST.3 Y_RST.3 Z_RST.3
SPI1_MOSI: E0_MS1.3 E1_MS1.3 E2_MS1.3 EXP2.6 U1.32(PA7) X_MS1.3 Y_MS1.3 Z_MS1.3
SPI1_SCK: E0_MS2.3 E1_MS2.3 E2_MS2.3 EXP2.2 U1.30(PA5) X_MS2.3 Y_MS2.3 Z_MS2.3
SWCLK: R5.2 SWD.3 U1.76(PA14(JTCK-SWCLK))  [also labelled X-TX]
SWDIO: R6.2 SWD.1 U1.72(PA13(JTMS-SWDIO))  [also labelled Y-TX]
THERM0: R43.2 R82.1 Thermistors.2
THERM0_ADC: C29.2 R82.2 U1.33(PC4)
THERM1: R42.2 R84.1 Thermistors.4
THERM1_ADC: C28.2 R84.2 U1.18(PC3)
THERM2: R41.2 R81.1 Thermistors.6
THERM2_ADC: C27.2 R81.2 U1.17(PC2)
THERM3: R40.2 R83.1 Thermistors.8
THERM3_ADC: C26.2 R83.2 U1.16(PC1)
THERM4: R54.2 R85.1 Thermistors.10
THERM4_ADC: C9.2 R85.2 U1.15(PC0)
USB_D_N: R7.1 U1.70(PA11)
USB_D_P: R8.1 U1.71(PA12)
USB_N: J2.D- R7.2 U5.1(IO1) USB_AUX.4
USB_P: J2.D+ R8.2 U5.3(IO2) USB_AUX.3
X-CS/RX: R5.1 U1.8(PC14-OSC32_IN(PC14)) X_MS3.3
X-DIR: U1.9(PC15-OSC32_OUT(PC15)) X.8(DIR)
X-EN: R21.2 U1.79(PC11) X.1(~{ENA})
X-MAX: C2.2 R62.2 R63.2 U1.52(PB13)
X-MIN: C1.2 R18.2 R60.2 U1.51(PB12)
X-~{SLP}: X.6(~{SLEEP}) X_RST.1
X-STEP: U1.23(PA0-WKUP(PA0)) X.7(STEP)
Y-CS/RX: R6.1 U1.3(PE4) Y_MS3.3
Y-DIR: U1.5(PE6) Y.8(DIR)
Y-EN: R23.2 U1.2(PE3) Y.1(~{ENA})
Y-MAX: C36.2 R71.2 R72.2 U1.55(PD8)
Y-MIN: C31.2 R68.2 R69.2 U1.54(PB15)
Y-~{SLP}: Y.6(~{SLEEP}) Y_RST.1
Y-STEP: U1.4(PE5) Y.7(STEP)
Z-CS/RX: R16.1 U1.97(PE0) Z_MS3.3
Z-DIR: U1.1(PE2) Z.8(DIR)
Z-EN: R25.2 U1.93(PB7) Z.1(~{ENA})
Z-MAX: C42.2 R77.2 R78.2 U1.57(PD10)
Z-MIN: C41.2 R74.2 R75.2 U1.56(PD9)
Z-~{SLP}: Z.6(~{SLEEP}) Z_RST.1
Z-STEP: U1.98(PE1) Z.7(STEP)
Z-TX: R16.2 U1.47(PB10)
NetC5_2: C5.2 U1.73(VCAP_2)
NetC6_2: C6.2 U1.48(VCAP_1)
NetC10_1: C10.1 R19.1
NetC18_1: C18.1 L1.1 U3.5(SW)
NetC18_2: C18.2 U3.6(BST)
NetC33_1: C33.1 U4.2(BST)
NetC33_2: C33.2 D8.K L2.1 U4.1(LX)
NetC34_2: C34.2 U4.7(SS)
NetD1_A: D1.A Q7.1(G) R80.1
NetD4_A: D4.A F3.2
NetD9_A: D9.A HE1.2 Q2.2(D)
NetD10_A: D10.A FAN0.2 FAN0_1.2 Q4.2(D)
NetD10_K: D10.K FAN0.1 FAN0_1.1 VFA0_sel.2
NetD11_A: D11.A FAN1.2 FAN1_1.2 Q5.2(D)
NetD11_K: D11.K FAN1.1 FAN1_1.1 VFA1_sel.2
NetD12_A: D12.A HE0.2 Q1.2(D)
NetD13_A: D13.A HB-OUT.1 Q6.2(D)
NetD14_A: D14.A HE2.2 Q3.2(D)
NetD14_K: D14.K HE2.1 VHE2_sel.2
NetE0_2: E0.2(MS1/SDI) E0_MS1.2 R28.1
NetE0_3: E0.3(MS2/SCK) E0_MS2.2
NetE0_4: E0.4(MS3/CS/UART) E0_MS3.2
NetE0_5: E0.5(~{RST}/SDO) E0_RST.2
NetE0_11: E0.11(1B) E0_MOT.1 E0_MOT_A.4
NetE0_12: E0.12(1A) E0_MOT.2 E0_MOT_A.3
NetE0_13: E0.13(2A) E0_MOT.3 E0_MOT_A.2
NetE0_14: E0.14(2B) E0_MOT.4 E0_MOT_A.1
NetE0_DIAG_1: E0_DIAG.1 R62.1
NetE1_2: E1.2(MS1/SDI) E1_MS1.2 R30.1
NetE1_3: E1.3(MS2/SCK) E1_MS2.2
NetE1_4: E1.4(MS3/CS/UART) E1_MS3.2
NetE1_5: E1.5(~{RST}/SDO) E1_RST.2
NetE1_11: E1.11(1B) E1_MOT.1 E1_MOT_A.4
NetE1_12: E1.12(1A) E1_MOT.2 E1_MOT_A.3
NetE1_13: E1.13(2A) E1_MOT.3 E1_MOT_A.2
NetE1_14: E1.14(2B) E1_MOT.4 E1_MOT_A.1
NetE1_DIAG_1: E1_DIAG.1 R71.1
NetE2_2: E2.2(MS1/SDI) E2_MS1.2 R44.1
NetE2_3: E2.3(MS2/SCK) E2_MS2.2
NetE2_4: E2.4(MS3/CS/UART) E2_MS3.2
NetE2_5: E2.5(~{RST}/SDO) E2_RST.2
NetE2_11: E2.11(1B) E2_MOT.1 E2_MOT_A.4
NetE2_12: E2.12(1A) E2_MOT.2 E2_MOT_A.3
NetE2_13: E2.13(2A) E2_MOT.3 E2_MOT_A.2
NetE2_14: E2.14(2B) E2_MOT.4 E2_MOT_A.1
NetE2_DIAG_1: E2_DIAG.1 R77.1
NetF1_0: F1.0 HB-PWR.2
NetF2_1: F2.1 MAIN-PWR.2
NetFB2_1: FB2.1 J2.SHIELD(SH) USB_AUX.1
NetLD1_1: LD1.1(A) R4.1
NetLD2_1: LD2.1(A) R33.1
NetLD3_1: LD3.1(A) R36.1
NetLD4_1: LD4.1(A) R39.1
NetLD5_1: LD5.1(A) R50.1
NetLD6_1: LD6.1(A) R53.1
NetLD7_1: LD7.1(A) R55.1
NetLD8_2: LD8.2(K) R20.2
NetLD9_2: LD9.2(K) R58.2
NetLD10_2: LD10.2(K) R59.2
NetLD11_2: LD11.2(K) R15.2
NetLED1_1: LED1.1(A) R13.1
NetQ1_1: Q1.1(G) R34.2
NetQ2_1: Q2.1(G) R37.2
NetQ3_1: Q3.1(G) R48.2
NetQ4_1: Q4.1(G) R51.2
NetQ5_1: Q5.1(G) R46.2
NetQ6_1: Q6.1(G) U2.4(Y)
NetR1_1: R1.1 U1.95(PB8)
NetR9_1: R9.1 U1.96(PB9)
NetR10_2: R10.2 U4.4(FSW)
NetR17_2: R17.2 R60.1 X-.1
NetR18_1: R18.1 X_DIAG.1
NetR19_2: R19.2 U4.5(COMP)
NetR22_1: R22.1 X.2(MS1/SDI) X_MS1.2
NetR24_1: R24.1 Y.2(MS1/SDI) Y_MS1.2
NetR26_1: R26.1 Z.2(MS1/SDI) Z_MS1.2
NetR31_2: R31.2 U2.2(A)
NetR56_2: R56.2 R57.2 U4.6(FB)
NetR61_2: R61.2 R63.1 X+.1
NetR67_2: R67.2 R69.1 Y-.1
NetR68_1: R68.1 Y_DIAG.1
NetR70_2: R70.2 R72.1 Y+.1
NetR73_2: R73.2 R75.1 Z-.1
NetR74_1: R74.1 Z_DIAG.1
NetR76_2: R76.2 R78.1 Z+.1
NetR79_1: R79.1 U4.8(EN)
NetU1_12: U1.12(PH0-OSC_IN(PH0)) XT1.3(OUT)
NetU1_13: U1.13(PH1-OSC_OUT(PH1)) XT1.1(IN)
NetX_3: X.3(MS2/SCK) X_MS2.2
NetX_4: X.4(MS3/CS/UART) X_MS3.2
NetX_5: X.5(~{RST}/SDO) X_RST.2
NetX_11: X.11(1B) X_MOT.1 X_MOT_A.4
NetX_12: X.12(1A) X_MOT.2 X_MOT_A.3
NetX_13: X.13(2A) X_MOT.3 X_MOT_A.2
NetX_14: X.14(2B) X_MOT.4 X_MOT_A.1
NetY_3: Y.3(MS2/SCK) Y_MS2.2
NetY_4: Y.4(MS3/CS/UART) Y_MS3.2
NetY_5: Y.5(~{RST}/SDO) Y_RST.2
NetY_11: Y.11(1B) Y_MOT.1 Y_MOT_A.4
NetY_12: Y.12(1A) Y_MOT.2 Y_MOT_A.3
NetY_13: Y.13(2A) Y_MOT.3 Y_MOT_A.2
NetY_14: Y.14(2B) Y_MOT.4 Y_MOT_A.1
NetZ_3: Z.3(MS2/SCK) Z_MS2.2
NetZ_4: Z.4(MS3/CS/UART) Z_MS3.2
NetZ_5: Z.5(~{RST}/SDO) Z_RST.2
NetZ_11: Z.11(1B) Z_MOT.1 Z_MOT_A.4
NetZ_12: Z.12(1A) Z_MOT.2 Z_MOT_A.3
NetZ_13: Z.13(2A) Z_MOT.3 Z_MOT_A.2
NetZ_14: Z.14(2B) Z_MOT.4 Z_MOT_A.1

Not connected (* = marked no-connect by the designer): E0_0 1 2 3 4 5 6 7 8; E0_1 1 2 3 4 5 6 7 8; E0_DIAG 2; E1_0 1 2 3 4 5 6 7 8; E1_1 1 2 3 4 5 6 7 8; E1_DIAG 2; E2_0 1 2 3 4 5 6 7 8; E2_1 1 2 3 4 5 6 7 8; E2_DIAG 2; J2 ID*; U1 78(PC10)*; U5 4(IO3)* 6(IO4)*; X_0 1 2 3 4 5 6 7 8; X_1 1 2 3 4 5 6 7 8; X_DIAG 2; Y_0 1 2 3 4 5 6 7 8; Y_1 1 2 3 4 5 6 7 8; Y_DIAG 2; Z_0 1 2 3 4 5 6 7 8; Z_1 1 2 3 4 5 6 7 8; Z_DIAG 2

## Layout directives
differential pair: USB_D_N, USB_D_P, USB_N, USB_P

## Notes on the sheet
- Pins in
- and will not collide with one another
- Interrupt Allocation
- BOLD
- are interrupt-capable
- INT00 -
  INT01 - PB02 - BTN_EN1
  INT02 - PB02 - BTN_EN2
  INT03 -
  INT04 -
  INT05 - PC05 - KILL
  INT06 -
  INT07 - PE07 - BTN_ENC
  INT08 - PD08 - Y-MAX
  INT09 - PD09 - Z-MIN
  INT10 - PD10 - Z-MAX
  INT11
  INT12 - PB12 - X-MIN
  INT13 - PB13 - X-MAX
  INT14 -
  INT15 - PB15 - Y-MIN
- ADC Allocation
- THERM0 - ADC12_IN14
  THERM1	- ADC123_IN13
  THERM2	- ADC123_IN12
  THERM3	- ADC123_IN11
  THERM4	- ADC123_IN10
- Special Pins
- The following pins initialise to alternate functions with pull-up/pull-down on reset, and should be avoided as GPIO if possible:
  Pin	-	Reset Behaviour
  PA15	-	pull-up
  PA14	- 	pull-down
  PA13	-	pull-up
  PB4	-	pull-up
  PB3	-	floating
- MS1 = 1, MS2 = 2, MS3 = 3
- Microstepping
- MS1 = 0, MS2 = 0, MS3 = 0
- SPI-Mode
- UART-Mode
- Four 3-way jumpers per driver allow selection and configuration of microstepping mode (A4988, DRV8825, TMC2100, etc.), SPI mode (TMC2130 etc.) or UART mode (TMC2208, TMC2209).
- SLP
- MS3
- MS2
- MS1
- BOOT0 Button
- BED MOSFET Notes
- (near S1) Reset Button
- Logic buffer IC is used to drive MOSFET with 5V signal.
  PSMN1R8-40YLC RDSon (max) @ 4.5V = 2.1mΩ
  Must be able to handle up to 20A.
- P = I^2 x R
  = 20^2 x 2.1mΩ
  = 0.84W
- Alternatives:
  PSMN1R4-40YLDX (1.85mΩ)
  PSMN1R0-40YLDX (1.40mΩ)
- (U1_RX, PWM)
- (ADC, PWM)
- (PWM)
- (I2C)
- (U1_TX, PWM)
- (ADC)
- Heater/Fan MOSFET Notes
- BUK9Y14-40B RDSon (max) @ 3V = 15mΩ
  Must be able to handle up to 5A.
- P = I^2 x R
  = 5^2 x 15mΩ
  = .375W
- Alternatives:
  PSMN7R5-60YLX (9mΩ)
  BUK9Y4R4-40E (6mΩ)
- For TMC stepper drivers, VMOT must be present when logic rail is powered or IO are driven, or damage may occur.
  If VIN is present, Q7 closes and VIN powers VMOT with minimal voltage drop.
  If VIN is not present, Q7 opens and +5V powers VMOT via D3.
- (near J3) Stepper drivers are provided with 3V power by default. Logic signals from microcontroller are 3V - some drivers (A4988) will only work with 3V logic when running on 3V power. Others (DRV8825, TMC2130) will work with 3V logic powered from 3V or 5V.
  All known drivers should work with 3V power, but jumper J3 can be cut and set to 5V if required.
- 4 x M3 mounting holes
- (near JMP#1) 28 x PCB Jumpers
- 5V 2A Buck Regulator
- 3.3V 600mA LDO Regulator
- 12V 4A Buck Regulator
- GPLv3
- aus3d.com.au/rumba32 <http://aus3d.com.au/rumba32>
- RUMBA32 design by Chris Barr for Aus3D.
- See GitHub page for change history and details.
- Aus3D
- github.com/Aus3D/RUMBA32 <http://github.com/Aus3D/RUMBA32>
- Date: 18/05/2020
- REV: 1.1B
- Title
- Size:
- Date:
- File:
- A1
- Number:
- Time:
- Revision:
- Sheet
- of

## Library data of the parts
3V3 5V 5VDC 12V FAN0_1 FAN1_1 PS_ON PWR = Header 2: Header, 2-Pin; Manufacturer 1: Generic Header; Note: Approved sub OK; LatestRevisionDate: 17-Jul-2002; LatestRevisionNote: Re-released for DXP Platform.; Publisher: Altium Limited
C1 C2 C31 C36 C41 C42 = UMK105B7222KV-F: CAP CER 2.2NF 50V X7R 0402; Manufacturer 1: Taiyo Yuden; Note: Approved sub OK; Tolerance: ±10%; Type: X5R; Revision: July-2002: Re-released for DXP Platform.; Voltage: 50V; Supplier 1: Digi-Key; Supplier Part Number 1: 587-1221-1-ND; Package: 0402; Manufacturer Part Number 1: UMK105B7222KV-F; Temperature Coefficient: X7R; Operating Temperature: -55°C ~ 125°C; Package / Case: 0402 (1005 Metric); Size / Dimension: 0.039" L x 0.020" W (1.00mm x 0.50mm); Thickness (Max): 0.022" (0.55mm)
C4 C9 C26-C29 = EMK105BJ105KV-F: CAP CER 1UF 16V X5R 0402; Manufacturer 1: Taiyo Yuden; Tolerance: ±10%; Note: Approved sub OK; Package / Case: 0402 (1005 Metric); Supplier 1: Digi-Key; Supplier Part Number 1: 587-2477-1-ND; Manufacturer Part Number 1: EMK105BJ105KV-F; Revision: July-2002: Re-released for DXP Platform.; Voltage: 16V; Package: 0402; Type: X5R; Temperature Coefficient: X5R; Operating Temperature: -55°C ~ 85°C; Size / Dimension: 0.039" L x 0.020" W (1.00mm x 0.50mm); Thickness (Max): 0.022" (0.55mm)
C5 C6 C12 C35 = LMK105BBJ475MVLF: CAP CER 4.7UF 10V X5R 0402; Manufacturer 1: Taiyo Yuden; Tolerance: ±20%; Note: Approved sub OK; Package / Case: 0402 (1005 Metric); Supplier 1: Digi-Key; Supplier Part Number 1: 587-3408-1-ND; Manufacturer Part Number 1: LMK105BBJ475MVLF; Revision: July-2002: Re-released for DXP Platform.; Voltage: 10V; Package: 0402; Type: X5R; Temperature Coefficient: X5R; Operating Temperature: -55°C ~ 85°C; Size / Dimension: 0.039" L x 0.020" W (1.00mm x 0.50mm); Thickness (Max): 0.022" (0.55mm)
C7 C38 C39 = LMK107BBJ106KALT: CAP CER 10UF 10V X5R 0603; Manufacturer 1: Taiyo Yuden; Note: Approved sub OK; Tolerance: ±10%; Revision: July-2002: Re-released for DXP Platform.; Supplier 1: Digi-Key; Supplier Part Number 1: 587-6017-1-ND; Voltage: 10V; Package: 0402; Type: X5R; Manufacturer Part Number 1: LMK107BBJ106KALT; Temperature Coefficient: X5R; Operating Temperature: -55°C ~ 85°C; Package / Case: 0603 (1608 Metric); Size / Dimension: 0.063" L x 0.031" W (1.60mm x 0.80mm); Thickness (Max): 0.039" (1.00mm)
C8 C10 C11 C13-C16 C18-C20 C33 C34 C40 = UMK105B7104KV-FR: CAP CER 0.1UF 50V X7R 0402; Manufacturer 1: Taiyo Yuden; Note: Approved sub OK; Tolerance: ±10%; Type: X5R; Revision: July-2002: Re-released for DXP Platform.; Supplier 1: Digi-Key; Supplier Part Number 1: 587-3498-1-ND; Voltage: 50V; Package: 0402; Manufacturer Part Number 1: UMK105B7104KV-FR; Temperature Coefficient: X7R; Operating Temperature: -55°C ~ 125°C; Package / Case: 0402 (1005 Metric); Size / Dimension: 0.039" L x 0.020" W (1.00mm x 0.50mm); Thickness (Max): 0.022" (0.55mm)
C17 C37 C45 = GMJ325KB7106KMHP: CAP CER 10UF 35V X7R 1210; Manufacturer 1: Taiyo Yuden; Note: Approved sub OK; Tolerance: ±10%; Type: X5R; Revision: July-2002: Re-released for DXP Platform.; Package: 0402; Supplier 1: Digi-Key; Supplier Part Number 1: 587-4890-1-ND; Manufacturer Part Number 1: GMJ325KB7106KMHP; Temperature Coefficient: X7R; Operating Temperature: -55°C ~ 125°C; Package / Case: 1210 (3225 Metric); Size / Dimension: 0.126" L x 0.098" W (3.20mm x 2.50mm); Thickness (Max): 0.110" (2.80mm)
C21-C25 C30 C32 = CapE-6.3-100uF-35V: CAP ALUM 100UF 20% 35V SMD; Note: Approved sub OK; Published: 8-Jun-2000; Revision: July-2002: Re-released for DXP Platform.; Publisher: Altium Limited; Supplier 1: Digi-Key; Supplier Part Number 1: PCE5016CT-ND
C43 C44 = EMJ325KB7226KMHP: CAP CER 22UF 16V X7R 1210; Manufacturer 1: Taiyo Yuden; Note: Approved sub OK; Tolerance: ±10%; Type: X5R; Revision: July-2002: Re-released for DXP Platform.; Supplier 1: Digi-Key; Supplier Part Number 1: 587-5657-1-ND; Package: 0402; Manufacturer Part Number 1: EMJ325KB7226KMHP; Temperature Coefficient: X7R; Operating Temperature: -55°C ~ 125°C; Package / Case: 1210 (3225 Metric); Size / Dimension: 0.126" L x 0.098" W (3.20mm x 2.50mm); Thickness (Max): 0.110" (2.80mm)
D1 = Diode Zener 10V: DIODE ZENER 10V 500mW SOD523; Code - JEDEC: DO-214-AB; Note: Approved sub OK; Published: 8-Jun-2000; Revision: July-2002: Re-released for DXP Platform.; Publisher: Altium Limited; Supplier 1: Digi-Key; Supplier Part Number 1: MM5Z10VT1GOSCT-ND
D3 = Diode Schottky 2A 40V (SS24FL): DIODE SCHOTTKY 40V 2A SOD123F; Code - JEDEC: DO-214-AB; Note: Approved sub OK; Published: 8-Jun-2000; Revision: July-2002: Re-released for DXP Platform.; Publisher: Altium Limited; Supplier 1: Digi-Key; Supplier Part Number 1: SS24FLCT-ND
D4 D15 = Diode Schottky 2A 40V (SS24FL): DIODE SCHOTTKY 40V 2A SOD123F; Code - JEDEC: DO-214-AB; VALUE: 40V 2A; Note: Approved sub OK; Published: 8-Jun-2000; Revision: July-2002: Re-released for DXP Platform.; Publisher: Altium Limited; Supplier 1: Digi-Key; Supplier Part Number 1: SS24FLCT-ND
D6 D7 D9-D14 = DIODE_100V_1.5A_SMA: DIODE GEN PURP 100V 1.5A SMA; Manufacturer 1: Diodes Inc; Manufacturer Part Number 1: S2BA-13-F; Ratings: 100V; 1.5A; Material: Si; Diode Type: Standard; Value: 1.5A 100V; SCDType: source; Note: Approved sub OK; Package / Case: DO-214AC, SMA; Supplier 1: Digi-Key; Supplier Part Number 1: S2BA-FDICT-ND
D8 = Diode Schottky - 40V 4A - SSB44-E3: DIODE SCHOTTKY 40V 4A DO214AA; Code - JEDEC: DO-214-AA; Note: Approved sub OK; Published: 8-Jun-2000; Revision: July-2002: Re-released for DXP Platform.; Publisher: Altium Limited; Supplier 1: Digi-Key; Supplier Part Number 1: SSB44-E3/52TGICT-ND
E0-E2 X Y Z = STEPSTICK_BREAKOUT: Header, 8-Pin, Female; Manufacturer 1: Generic Header; Note: Approved sub OK
E0_0 E0_1 E1_0 E1_1 E2_0 E2_1 X_0 X_1 Y_0 Y_1 Z_0 Z_1 = Header 8x1: Header, 8-Pin, Female; Manufacturer 1: Generic Header; Note: Approved sub OK; LatestRevisionDate: 17-Jul-2002; LatestRevisionNote: Re-released for DXP Platform.; Publisher: Altium Limited
E0_DIAG E1_DIAG E2_DIAG X_DIAG Y_DIAG Z_DIAG = Header 1X2 Female: Header, 2-Pin, Female; Manufacturer 1: Generic Header; Note: Approved sub OK
E0_MOT E1_MOT E2_MOT X_MOT Y_MOT Z_MOT = ScrewTerminal-3.5mm-4Way: TERM BLK 4POS SIDE ENT 3.5MM PCB; Note: Approved sub OK; LatestRevisionDate: 17-Jul-2002; LatestRevisionNote: Re-released for DXP Platform.; Publisher: Altium Limited; Supplier 1: Digi-Key; Supplier Part Number 1: 277-5744-ND
E0_MOT_A E1_MOT_A E2_MOT_A X_MOT_A Y_MOT_A Z_MOT_A = Header 4_1: Header, 4-Pin; Manufacturer 1: Generic Header; Note: Approved sub OK; LatestRevisionDate: 17-Jul-2002; LatestRevisionNote: Re-released for DXP Platform.; Publisher: Altium Limited
E0_MS1-E0_MS3 E0_RST E1_MS1-E1_MS3 E1_RST E2_MS1-E2_MS3 E2_RST SERVO VFA0_sel VFA1_sel VHE2_sel X+ X- X_MS1-X_MS3 X_RST Y+ Y- Y_MS1-Y_MS3 Y_RST Z+ Z- Z_MS1-Z_MS3 Z_RST = Header 3: Header, 3-Pin; Manufacturer 1: Generic Header; Note: Approved sub OK; LatestRevisionDate: 17-Jul-2002; LatestRevisionNote: Re-released for DXP Platform.; Publisher: Altium Limited
EXP1 EXP2 Thermistors = Header 5X2: Header, 5-Pin, Dual row; Manufacturer 1: Generic Header; Note: Approved sub OK; LatestRevisionDate: 17-Jul-2002; LatestRevisionNote: Re-released for DXP Platform.; Publisher: Altium Limited
EXP3 = Header 7X2: Header, 7-Pin, Dual row; Manufacturer 1: Generic Header; Note: Approved sub OK; LatestRevisionDate: 17-Jul-2002; LatestRevisionNote: Re-released for DXP Platform.; Publisher: Altium Limited
F1 F2 = Fuseholder - Mini ATC ATO 15A: FUSE HOLDER BLADE PCB; Note: Approved sub OK; Supplier 1: Digi-Key; Supplier Part Number 1: BK-6013-ND
F3 = Fuse - 15V 200mA Trip PTC SMD 0603: PTC RESET FUSE 9V 200MA 0603; Manufacturer 1: Holly Fuse; Manufacturer Part Number 1: 06T-0160L; Ratings: 160mA; 63VDC; slow-blow; SCDType: spec; Note: Approved sub OK; Package / Case: 0603 (1608 metric); Supplier 1: Digi-Key; Supplier Part Number 1: 507-1821-1-ND
FAN0 FAN1 HE0-HE2 = ScrewTerminal-3.5mm-2Way: TERM BLK 2POS SIDE ENT 3.5MM PCB; Note: Approved sub OK; Supplier 1: Digi-Key; Supplier Part Number 1: 277-5719-ND
FB1 FB2 = Ferrite Bead SMD 0402 - 120R: FERRITE BEAD 120R 300MA 0402; Note: Approved sub OK; Published: 24-Mar-1999; Revision: July-2002: Re-released for DXP Platform.; Publisher: Altium Limited; Supplier 1: Digi-Key; Supplier Part Number 1: 587-1836-1-ND
HB-OUT HB-PWR MAIN-PWR = ScrewTerminal-5mm-2Way: TERM BLK 2POS SIDE ENTRY 5MM PCB; Supplier 1: Digi-Key; Supplier Part Number 1: 277-6405-ND
I2C_1 I2C_2 = Header 4: Header, 4-Pin; Manufacturer 1: Generic Header; Note: Approved sub OK; LatestRevisionDate: 17-Jul-2002; LatestRevisionNote: Re-released for DXP Platform.; Publisher: Altium Limited
J1 J3 = JUMP_3WAY: SMD jumper
J2 = Micro-USB B Socket: CONN RCPT USB2.0 MICRO B SMD R/A; Note: Approved sub OK; Supplier 1: Digi-Key; Supplier Part Number 1: WM1399CT-ND
JMP1 JMP#1-JMP#27 = PCB Jumper: 2.54mm .1" PCB Jumper, Green; Note: Installed as per drawing, approved sub OK; Supplier 1: Digi-Key; Supplier Part Number 1: S9337-ND
L1 L2 = Inductor SMD 33uH 2.5A: FIXED IND 4.7UH 4.5A 26 MOHM SMD; Note: Approved sub OK; Published: 24-Mar-1999; Revision: July-2002: Re-released for DXP Platform.; Publisher: Altium Limited; Supplier 1: Digi-Key; Supplier Part Number 1: SRN6045TA-4R7MCT-ND
LD1-LD11 = LEDG  0603: LED GREEN CLEAR CHIP SMD 0603; Note: Approved sub OK; Supplier 1: Digi-Key; Supplier Part Number 1: 160-1435-2-ND
LED1 = LEDY  0603: LED YELLOW CLEAR CHIP SMD 0603; Note: Approved sub OK; Supplier 1: Digi-Key; Supplier Part Number 1: 160-1437-1-ND
OS_logo = Logo: Note: Approved sub OK
Q1-Q5 = MOSFET - BUK9Y21-40E: MOSFET N-CH 40V 56A LFPAK; Supplier 1: Digi-Key; Supplier Part Number 1: 1727-4940-1-ND
Q6 = MOSFET - PSMN1R8-40YLC: MOSFET N-CH 40V 100A LFPAK; Supplier 1: Digi-Key; Supplier Part Number 1: 1727-1052-1-ND
Q7 = MOSFET - Si2371EDS: MOSFET SMD P-CH 30V 4.8A SOT-23-3; FET Type: MOSFET P-Channel, Metal Oxide; Supplier 1: Digi-Key; Supplier Part Number 1: SI2371EDS-T1-GE3CT-ND
R1 R7-R9 R31 R34 R37 R46 R48 R51 = RC0402FR-0722RL: RES SMD 22 OHM 1% 1/16W 0402; Manufacturer 1: Yageo; Note: Approved sub OK; Temperature Coefficient: ±100ppm/°C; Published: 8-Jun-2000; Revision: July-2002: Re-released for DXP Platform.; Publisher: Altium Limited; Supplier 1: Digi-Key; Supplier Part Number 1: 311-22.0LRCT-ND; Manufacturer Part Number 1: RC0402FR-0722RL; Tolerance: ±1%; Operating Temperature: -55°C ~ 155°C; Package / Case: 0402 (1005 Metric); Size / Dimension: 0.039" L x 0.020" W (1.00mm x 0.50mm); Height - Seated (Max): 0.016" (0.40mm)
R2 R3 = RC0402FR-072K2L: RES SMD 2.2K OHM 1% 1/16W 0402; Manufacturer 1: Yageo; Note: Approved sub OK; Temperature Coefficient: ±100ppm/°C; Published: 8-Jun-2000; Revision: July-2002: Re-released for DXP Platform.; Publisher: Altium Limited; Supplier 1: Digi-Key; Supplier Part Number 1: 311-2.20KLRCT-ND; Manufacturer Part Number 1: RC0402FR-072K2L; Tolerance: ±1%; Operating Temperature: -55°C ~ 155°C; Package / Case: 0402 (1005 Metric); Size / Dimension: 0.039" L x 0.020" W (1.00mm x 0.50mm); Height - Seated (Max): 0.016" (0.40mm)
R4-R6 R13 R15 R16 R18 R20 R33 R36 R39 R50 R53 R55 R58 R62 R64-R66 R68 R71 R74 R77 = RC0402FR-071KL: RES SMD 1K OHM 1% 1/16W 0402; Manufacturer 1: Yageo; Note: Approved sub OK; Temperature Coefficient: ±100ppm/°C; Published: 8-Jun-2000; Revision: July-2002: Re-released for DXP Platform.; Publisher: Altium Limited; Supplier 1: Digi-Key; Supplier Part Number 1: 311-1.00KLRCT-ND; Manufacturer Part Number 1: RC0402FR-071KL; Tolerance: ±1%; Operating Temperature: -55°C ~ 155°C; Package / Case: 0402 (1005 Metric); Size / Dimension: 0.039" L x 0.020" W (1.00mm x 0.50mm); Height - Seated (Max): 0.016" (0.40mm)
R10 R12 R22 R24 R26 R28 R30 R32 R35 R38 R44 R47 R49 R52 = RC0402FR-07100KL: RES SMD 100K OHM 1% 1/16W 0402; Manufacturer 1: Yageo; Note: Approved sub OK; Temperature Coefficient: ±100ppm/°C; Published: 8-Jun-2000; Revision: July-2002: Re-released for DXP Platform.; Publisher: Altium Limited; Supplier 1: Digi-Key; Supplier Part Number 1: 311-100KLRCT-ND; Manufacturer Part Number 1: RC0402FR-07100KL; Tolerance: ±1%; Operating Temperature: -55°C ~ 155°C; Package / Case: 0402 (1005 Metric); Size / Dimension: 0.039" L x 0.020" W (1.00mm x 0.50mm); Height - Seated (Max): 0.016" (0.40mm)
R11 R14 R21 R23 R25 R27 R29 R45 R57 R60 R63 R69 R72 R75 R78-R85 = RC0402FR-0710KL: RES SMD 10K OHM 1% 1/16W 0402; Manufacturer 1: Yageo; Note: Approved sub OK; Temperature Coefficient: ±100ppm/°C; Published: 8-Jun-2000; Revision: July-2002: Re-released for DXP Platform.; Publisher: Altium Limited; Supplier 1: Digi-Key; Supplier Part Number 1: 311-10.0KLRCT-ND; Manufacturer Part Number 1: RC0402FR-0710KL; Tolerance: ±1%; Operating Temperature: -55°C ~ 155°C; Package / Case: 0402 (1005 Metric); Size / Dimension: 0.039" L x 0.020" W (1.00mm x 0.50mm); Height - Seated (Max): 0.016" (0.40mm)
R17 R40-R43 R54 R59 R61 R67 R70 R73 R76 = RC0402FR-074K7L: RES SMD 4.7K OHM 1% 1/16W 0402; Manufacturer 1: Yageo; Note: Approved sub OK; Temperature Coefficient: ±100ppm/°C; Published: 8-Jun-2000; Revision: July-2002: Re-released for DXP Platform.; Publisher: Altium Limited; Supplier 1: Digi-Key; Supplier Part Number 1: 311-4.7KLRCT-ND; Manufacturer Part Number 1: RC0402FR-074K7L; Tolerance: ±1%; Operating Temperature: -55°C ~ 155°C; Package / Case: 0402 (1005 Metric); Size / Dimension: 0.039" L x 0.020" W (1.00mm x 0.50mm); Height - Seated (Max): 0.016" (0.40mm)
R19 = RC0402FR-0754K9L: RES SMD 54.9K OHM 1% 1/16W 0402; Manufacturer 1: Yageo; Note: Approved sub OK; Temperature Coefficient: ±100ppm/°C; Published: 8-Jun-2000; Revision: July-2002: Re-released for DXP Platform.; Publisher: Altium Limited; Supplier 1: Digi-Key; Supplier Part Number 1: YAG3185CT-ND; Manufacturer Part Number 1: RC0402FR-0754K9L; Tolerance: ±1%; Operating Temperature: -55°C ~ 155°C; Package / Case: 0402 (1005 Metric); Size / Dimension: 0.039" L x 0.020" W (1.00mm x 0.50mm); Height - Seated (Max): 0.016" (0.40mm)
R56 = RC0402FR-07140KL: RES SMD 140K OHM 1% 1/16W 0402; Manufacturer 1: Yageo; Note: Approved sub OK; Temperature Coefficient: ±100ppm/°C; Published: 8-Jun-2000; Revision: July-2002: Re-released for DXP Platform.; Publisher: Altium Limited; Supplier 1: Digi-Key; Supplier Part Number 1: YAG2978CT-ND; Manufacturer Part Number 1: RC0402FR-07140KL; Tolerance: ±1%; Operating Temperature: -55°C ~ 155°C; Package / Case: 0402 (1005 Metric); Size / Dimension: 0.039" L x 0.020" W (1.00mm x 0.50mm); Height - Seated (Max): 0.016" (0.40mm)
S1 S3 = SW-PB: SWITCH TACTILE SPST-NO 0.05A 12V; Note: Approved sub OK; Supplier 1: Digi-Key; Supplier Part Number 1: 679-2396-1-ND
sc1-sc4 = Sraf: Note: Approved sub OK
SWD = Header 3X2: Header, 3-Pin, Dual row; Manufacturer 1: Generic Header; Note: Approved sub OK; LatestRevisionDate: 17-Jul-2002; LatestRevisionNote: Re-released for DXP Platform.; Publisher: Altium Limited
U1 = STM32F446VET6_Big: IC MCU 32BIT 512KB FLASH 100LQFP; Manufacturer: STMicroelectronics; PartNumber: STM32F407VGT7; Core: ARM Cortex-M4; D/A Converter: 2x12-bit; FLASH Size (Prog) (kB): 1024; I/Os (High Current): 82; Internal RAM Size (kB): 192; Operating Frequency(F) (Processor speed) (MHz): 168; Packing: Tray; Supply Voltage(Vcc) max (V): 3.6; Supply Voltage(Vcc) min (V): 1.8; DatasheetVersion: Rev. 4; PackageVersion: Rev. 1, 06/2013; PackageReference: LQFP100; PackageDescription: 100-Pin Low Profile Quad Flat Package, 14 x 14 mm Body, 0.5 mm Pitch; Mounting Technology: Surface Mount; ComponentLink1Description: Manufacturer URL; ComponentLink1URL: http://www.st.com/web/en/home.html; ComponentLink2Description: Datasheet; ComponentLink2URL: http://www.st.com/st-web-ui/static/active/en/resource/technical/document/datasheet/DM00037051.pdf; ComponentLink3Description: Package Specification; ComponentLink3URL: http://www.st.com/st-web-ui/static/active/en/resource/technical/document/data_brief/DM00071938.pdf; Supplier 1: Digi-Key; Supplier Part Number 1: 497-15375-ND
U2 = Buffer Non-Inverting Schmitt Trigger 74LVC1G17SE-7: IC BUF NON-INVERT 5.5V SOT353; Supplier 1: Digi-Key; Supplier Part Number 1: 74LVC1G17SE-7CT-ND
U3 = Regulator - AP63205 Buck Regulator: IC REG BUCK 5V 2A SOT23-6; Supplier 1: Digi-Key; Supplier Part Number 1: AP63205WU-7DICT-ND
U4 = Regulator - AOZ1284 4A Buck Regulator: IC REG BUCK ADJ 4A 8SO; Supplier 1: Digi-Key; Supplier Part Number 1: 785-1689-1-ND
U5 = USBLC6-4SC6 USB ESD Protection: DIODE TVS 5.25V 17V SOT23-6; Note: Approved sub OK; Supplier 1: Digi-Key; Supplier Part Number 1: 497-4492-1-ND
U6 = Regulator - AP2112K 3.3V Linear Regulator: IC REG LINEAR 3.3V 600MA SOT25; Supplier 1: Digi-Key; Supplier Part Number 1: AP2112K-3.3TRG1DICT-ND
U7 = EEPROM - Serial I2C: IC EEPROM 64K I2C SOT23-5; Supplier 1: Digi-Key; Supplier Part Number 1: 24LC64T-I/OTCT-ND
USB_AUX = Header 5x1: Header, 5-Pin; Manufacturer 1: Generic Header; Note: Approved sub OK; LatestRevisionDate: 17-Jul-2002; LatestRevisionNote: Re-released for DXP Platform.; Publisher: Altium Limited
XT1 = Ceramic Resonator CSTCE12M0G55-R0: CER RES 12.0000MHZ 33PF SMD; Note: Approved sub OK; Supplier 1: Digi-Key; Supplier Part Number 1: 490-17943-1-ND